# Altium project BEE-1012 PAY-IF V110.PrjPcb (part 3 of 8)
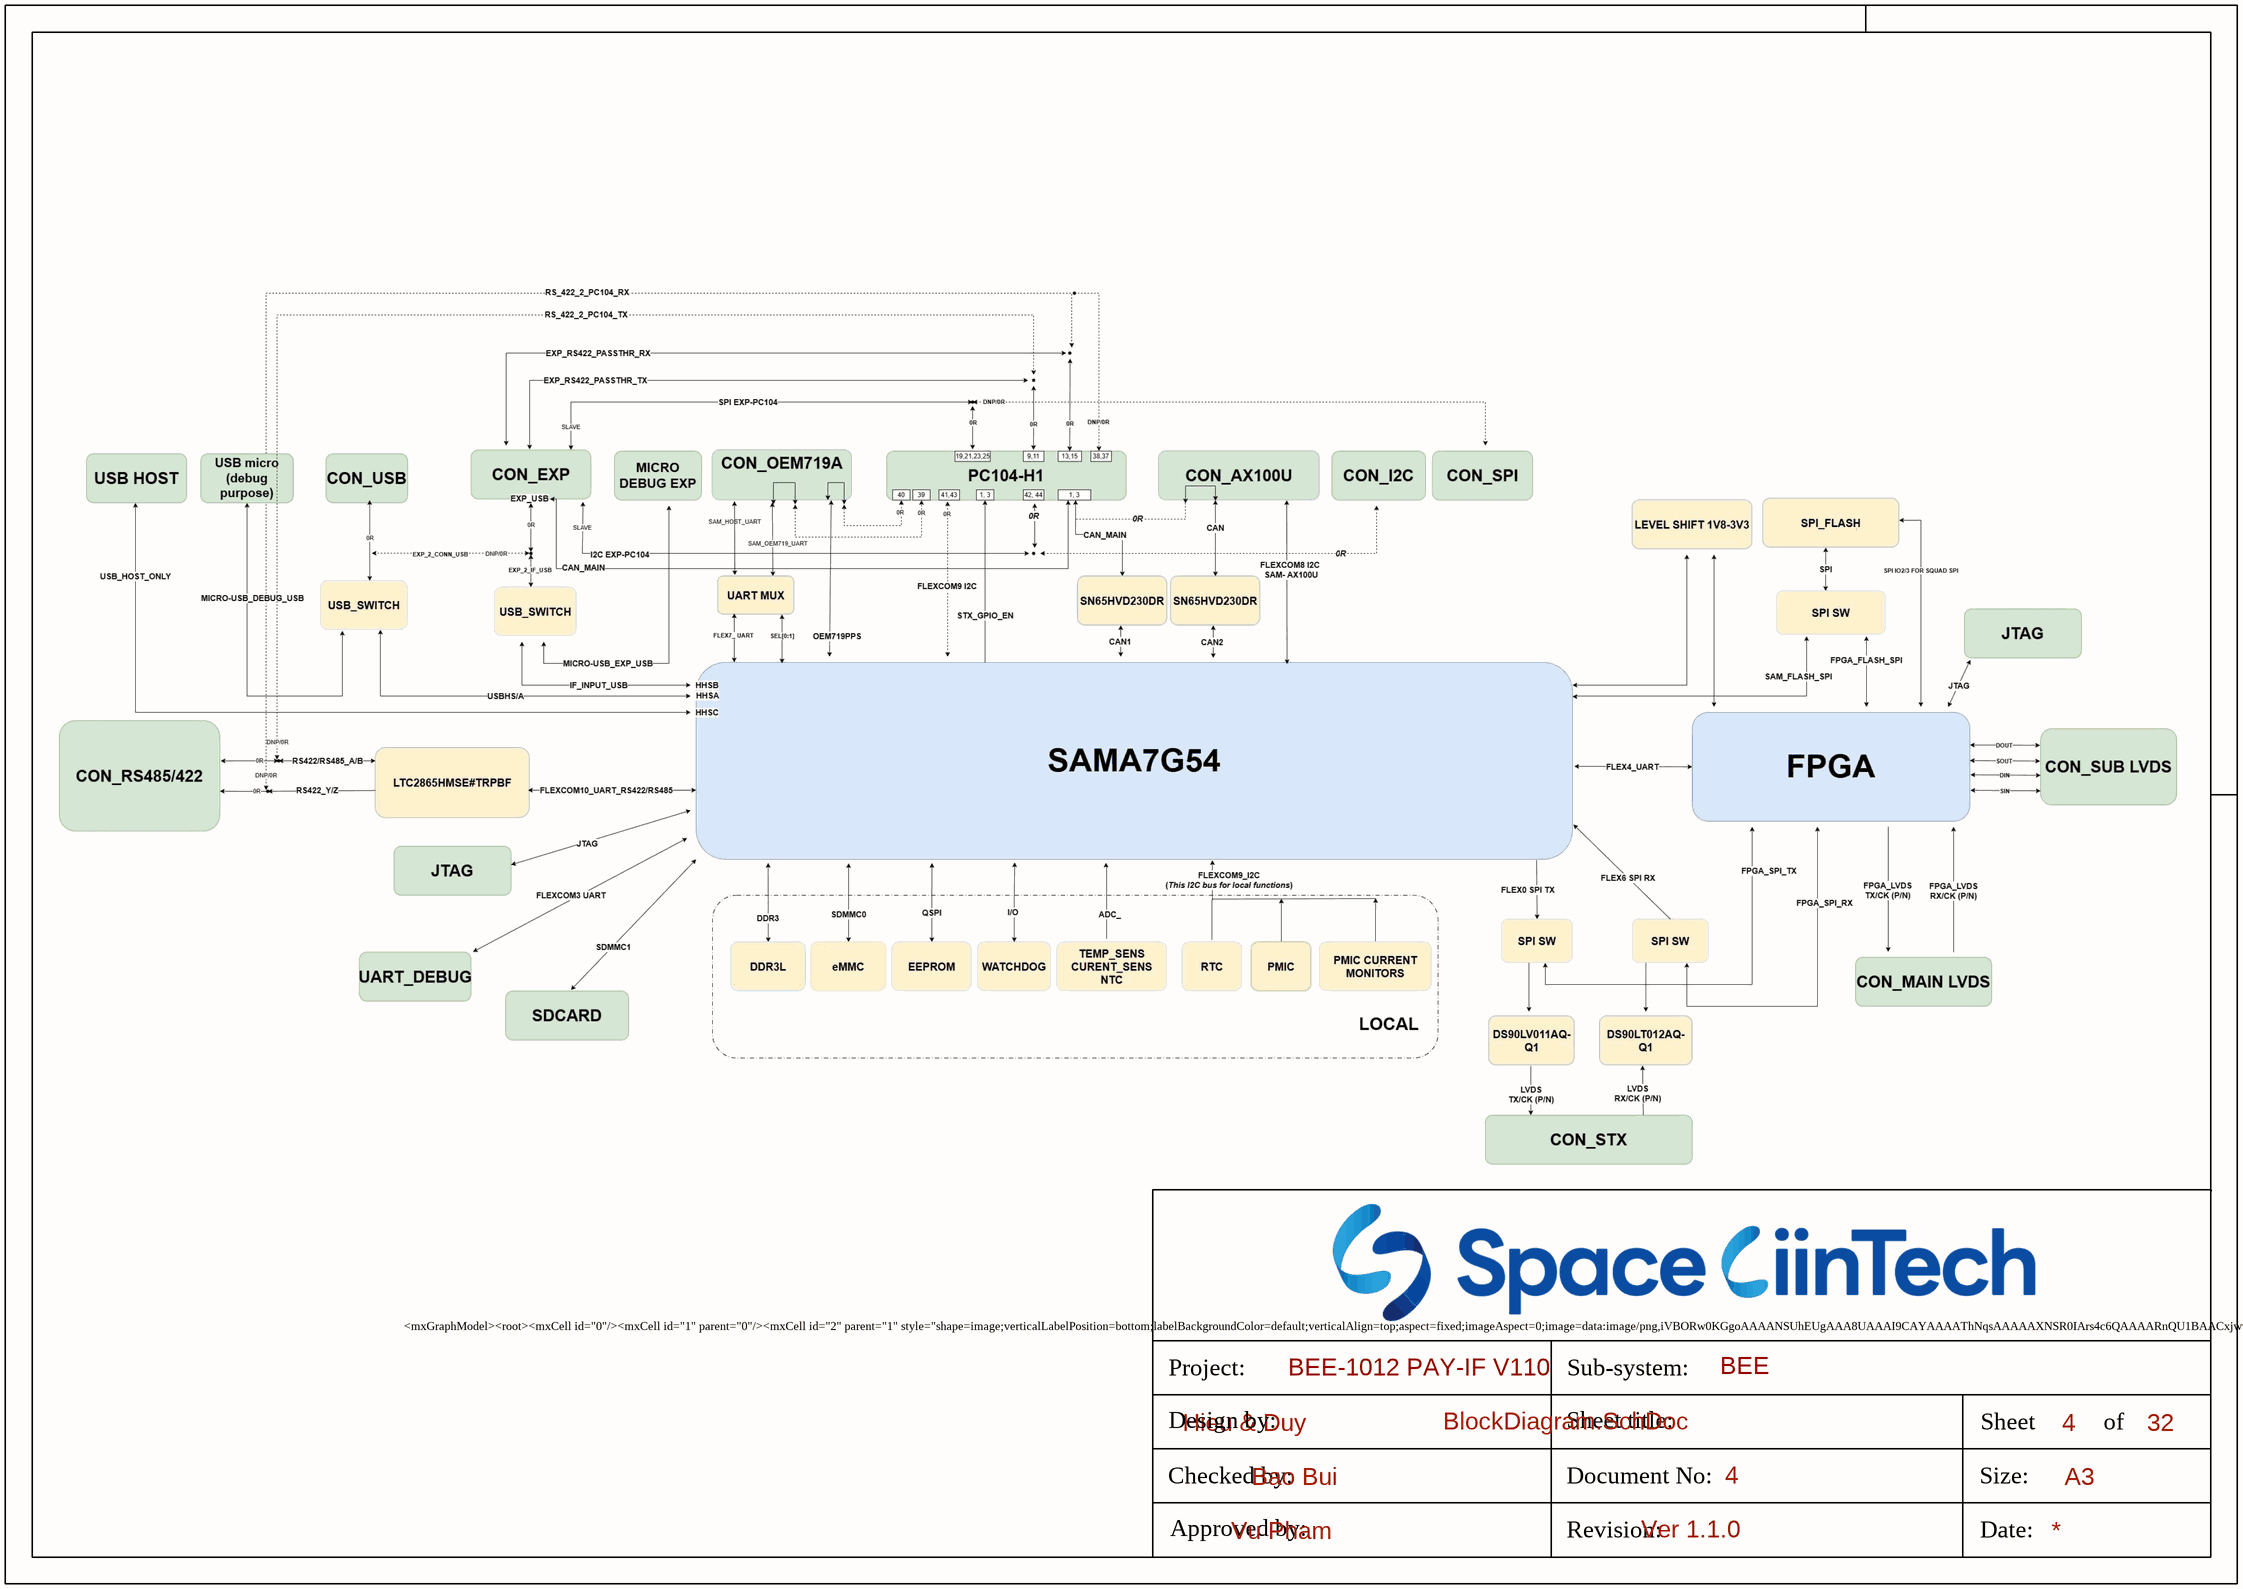
[diagram p40: BlockDiagram.SchDoc]

## Sheet BlockDiagram.SchDoc (continued)

### Notes on the sheet (continued)
JqvcTMV7Viu/XVq8e4P+ysQOpsY+cgftl/CTTGbK1QFBlSKSDqOwohJNKsQKHWWHbZzwsWz9ZQRYEslc7zK4TY5hW1xpJVG/St9bheu8T31fUY6Pg5Rfu2CP3aGnDN+aqy3LYfB0Pe8wbq2GzIe2Ubc1++foxoIiK6HAM1nyaiJixDdA2Yz69L36bTRERE5+Z7VrmQmmIiIiL6HnK8nnhEAiIionNiUExEREThOo9NTEREdNkYFBMREVGwamzirxlSioiIaGgMiomIiChQic+P3T87dWxGRER0udjRFtGJsQzRNWA+JyIiokvme1ZhTTERERERERFdLQbFREREREREdLUYFBMREREREdHVYlBMREREREREV2v0798/99fGO//995/9JyIiIiIiIqJv5d+/f/afAPY+TXR6LEN0DZjPiYiI6JL5nlXYfJqIiIiIiIiuFoNiIiIiIiIiuloMiomIiIiIiOhqMSgmIiIiIiKiq8WgmIiIiIiIiK4Wg2IiIiIiIiK6WgyKiYiIiIiI6GoxKCYiIiIiIqKrxaCYiIiIiIiIrhaDYiIiIiIiIrpaDIqJiIiIiIjoajEoJiIiIiIioqs1UFBcYhGNMBqFTdGitJbPkex/jxawf/Xrtu7RKEHesGx9u1y0bTXSalDmWCQRImsboyhCsshRhqxyr8yxSJJaWqNRhChKtunZyzjVj1mUtO5Jo3wRmdvT+RzaSpT5AklkpxshSjoes++iPLIM5El1DoPyL+rnPwrIxwf1vGNPh7xtL7qTJ/VlOk098ip9tfb8sy3nCRZ52ZiH6gLSNSZXnm9PI/i6fdbyDJT5wnmfOe5YBvoO97YoQdBh1M9X6/WlRL6ob+vX7veR+Q2oH7PWyVV2iIh+ANUiYBalVKYkoBA4ibRoXl6kyv7Vr9u6AaGM1WdS+02qTPvJJZO+/dAUmZLCXrd7ErJlnzuktU0v86fXcMxk2867FKkStbTaj2MjZ3r2JI7b1i+CkDKk73eXMqDlX29+1DmOcfjxdOcd9ySUdGyTXoaOmrocHzobhOTzTvkHuzzUdj1TR6Vbz5pd0hBKZrUEKmcqz0Uma2W5eXKXx8463I8u4t4Wcvz18+W5GIYeb08SW6fc75D9NTiOmXdylR0iou8BnmeVkdrO0Gg0GqFllt1byilWAAABKW/tGQz3T0vEY/0v2vIiRbGewfjZS19WIn2+x409i2GC2Fh5iUU0wXyz+6/MoJax9rumXCCazLGdVSJTSzjnNObbExDyFtsj84GP1cb4XaQF1jPHXucJounKkxbw8bHCxpyh5Tjq50vjXcYtT0aYbg8+hNjstsNzbHys4yZkiuenO0wAAAX+vL5gvjr8irRYw3XILk1QGdL3vct5yBOMtiegOQ9ZykWEySHD7wSv01/ePt/f8bYy86vMFPQiVeYJXt+1GQ70cmHmccP9E5bmBYQuQFA+b8k/+HzH+98PrA7lfKc1f7akW2PfB9CaxufnO97m/rx9cPLybN239oSAvK1KzcfHBzbWzcGfbotvem9rPE97+n41PQNo5wbY5ZGHe9zc7PLt2wr7bNu4zzjDfnvnc/Hn+zpX2SEi+h68zyp2lGwLmKXnW0rVc/k+y+4YNWdNb0ELlWpvdpvfBFtvXYVUaeFMUKkiU6kU2/lcCdo1ekKq5sqJQmX7tPaTK02lrGMmtTfWTfveREtHptrxOaam2Dy+TbUkhV6zf+z5PjOElKEz1SwZx/mocx9S3gqrNjg0P+hlJ3QZuhRB+Two/6htHkqtWjnv/KHp+oSkYeXtpvlOWp7NayUCahKLLD2U9eZ023y3e5vQ1tFyPWmtKQ67P21rgIXn93Psd4f8plTPZYmIvhd4nlUG+qb4mxvP8Cz3/9lg/uj4Jid/rd7KixRPjhfJAJAn2ltqkaJYLzEbN7xVHceYLdcoshTpvZ1gicWj9kZ+l1bzC9ox4uUaRSqqP61eAr6n+oWnw85v8PandYGDcvFyaB2QPt3ZP3djHd/fDW/Zx/ETDru4eUOHzSWYx1k8POHp4XAwO517vzHiZYZDkcIHPodKmq7EGPFsiXWR4nBF28zx2H5BO7Ex4id9m/6iMGc4uTzRa4gF0kJhvYy9NYPjeIblWqHIUjzc+eZs9u3ubbfP2n19hZfWBTzKP3gLuD9hHGO5XjfUEp9pv4mI6CgMineMh/jNHK9GTxI5kkOzKYH0d0PTpHKBl+qpoXk+yzieYWY/N+hBIiSywOZQ49nvKmjEBnNzR9zi+8O+b+avgZ1olPizf0oQDzjyOeug/Pw4/Fs83Hn2dYy7kwRy1yF/r/Lxw90Y47uHwwP+5u1P/WXQ0Sb4peXDv+eOHOhnGM/wWwsKwq9PJzS+0Zr1n/mFj3GPAWTW7ROScTzrNP/BN7236S8wNvPHrw0oz7jfRETUHYPigxjLrKrbWk2rHharGlEA8rnxoSJ/1d4Ce+YLUQUvgEifOnyfO8asej0OrN4DHiJjPB3uuiu8ty9g3ODlc9jN3af4W31AdXvjT80I5BhtdZDjkK32+XN8h+odw5A172PcOD8IJupmPHvWWh0EXp/O5hYtl6tBmfeYzP+d7IC+7b3NbgU2REB5ZOuAs+43ERF1xqBYpzfN3Te3Khd4rHrhQtb4FKIFHABkrclYF3pa2xq9TrSa39CaDD3QXL04mo8bSiwO1QYSvXZ1Z1JVK+IjZIP3Pj5btpUO8vfDy50qf+oPXAM9NAK1PPxr21sa0RH0l3bA6quj4vITh3Yt4teuI8BzMMtU2vQNz+C+973NaAV2bPNjo3XACtMkdKikvfPvNxERdcOg2DDG7LfZ3CrSvgGSmadHZf1BqW+gaKR1TE3EEU1Xu9QYat9XdXvjHaa19ld/QDnyrf01qmoqrPypP3ANVAthtK4YoHk9Xbex3uzgi1+E6bWmQ7SSCdb7vnCk735vM16qNPQZ0sp8MYPVFJNoO/5zkC/ZbyIi6uIEQfFf/Mlz5I1T4E3kKC3rDlm11dzqMCyCp3MtAEDx1xpiYSBH1USYTVfDal7Dawyrh8Ij3ng30GuqW9/mGw8YFET/JlDeWy8yYtxXUXG/5qlliTzRh3wK//6QqNHkV3V9aDXAfQBAUZYo9SlfIIn2Q9AB4ozNlwHrHnPUfeFI3/7eZjXBr/UZEmY8WyOTWi7crDCfTjDqEhzjvPvd3TBlh4joW7K7o7YFzFIfqsE7uYZ+6TMkQId1B6dtp+naZsuQQwUNkJY+bEh9eIim4x0yJE7TsvqQFU3L+pnD+Agl00xlRaGKolBFkaksrYYVqabj1nVOCClDJx3CRakirYb2cI7qoec55wx7dtnwTEK2lxtDSP6jS4WQfN54/WhhDGXjyhtd8mXTesPTaBsC6RTlWS/DzWW0fR8aF20ywP3oYIC0gu9t9o761t06JFOlyKyhwg6TULJpfCXfugMF73fn9NvzTN9tJyK6FPA8q5ygprjNMU2HzqxWE3ktvRy31xjqzWKHbjoYLwujl83VfIrpZILJZILJZIrpfI7VSaosfjqtp/Cm5o8DN6EWaQa1XvbqkIfoUm1WU0xGERJvk5YvULt31Z2ulvHCGcP5HT+81zheYq0KZKm0Wi9ssJpOMIqOaZ5NRERfbfigWKQolIJqnDzf5fbVtu6gIRCssQR3LmIokCO19eas04ewqHe4FRBc9TLGbDeWphR2Y0kBISTSrIBSWscpRzVFuzL6GJu1ptN75guRoDE9hUSaZciyDFmWQmpNCzfzKaKQNIi6aivzQ9wHGtIoikJrQrvBaj45Wz43vqtuMp7h96FMVlOqN/v9Qbrc2+xenPvd03fjaKv9/Ur7aTPH5MSBcbf97qAh33cqO0RE39TwQfE3Vy4eq7EEZYZMG6pomnhuofo3b307f+qdVglt2N9ufB1uacMwnaKDrb1xPMNyvbZuyGus10vM4rFZG3J7w5t0i/LPW9Ux0P3E/E5SmyZVVBw4ZvEv3MUx4jhGHM+wXK6hCr2jugl8RYYomP5d6xeW+fF4jHi5htKG7+sXXB3J05pjfCiT1XT3y56rg973I03vtHrc2wAgXqI6dYEv/1ps71eF9qywDYyN75a/er+JiKgVg2JDjldr+KVY76BjNW1+yDeGbOg5ZELvtApUw/52rdEd466Kio0Ot6rei4frYOso2gOy+Clj/RjnfEh6ngZW031zdMe070EIjhciocYzrPXxvmutDYi6M8Z4vYQybw3fV/vU5BTl+auG5el9P9L0TqvPvW1Lbw21mT/6O3UMNkY8W2sBtzV02AXsNxER+TEo1uTJ9PC9bFUTao2R2fiQbw6Z0O8b5J5paePRtjY1dDB66tzXSBi9Fz9/6bei+gPyyZqRfaUONQllW/WBnhc6OSLf7Vnf7h3T0ytRxRwn9zLKfIfegAcrz/onDv4RAobV835k6JlWz3sbsH1xp48wMeRxjLXWNubQYRew30RE5MWgeC9PDkNtABLPWtQ3nv0O6KBDr2Ht26TOSiuoKeteicUhegXEw90RTQ3r35eaTXC/8DW1Hpz/qDfm+kOTo+bJSf/G2117r79AkJnjGzF70ps/d8p3OjP/GjUmRB2ZY163DI13MU5Tno2gy9dyaVA/6d62FS+1filWL1iEvrU42mXsNxERNWNQDNRuOjKzOwML66DDqGHFCtPQzjbKvDbOoT2uojsQr8uTSfVNtBXcd2E0MXt7xGP1MfGXPpRWYySf9rvm87MCyWnizGMG7RtviAfUn6H1GrbAFwjGN+XH1/KarQ1axp0malDmiTbm9fA93h/P/MazXnt9ivJsN9sGVtPoLGXrJ93btvQWYBvMX96s349jNPO3gtfL2G8iImrCoBhW51pNQZ/VQYe7060YS/2jos0ckyhpHvC+zLFIIowmU8zf7VfVZrPtzXyCKFn404pGWm23K7jvwAiONlUg+mVvqUtz/0SK3z/s4aD+4Nmcd8pFhJF2sp3BgtbkLvwFwlC1vGZTz87NBenKlciTyPzOXWZYhmXiEyuRJ9o9o+GF0+DlGdi+oF1rtZzYYD6JkCxyT5Baovhr/62rH3Rv2zFbgFX3OJc8GWEUJcjLpo3cnsNqG101/Zex30RE5DZSSin7j7rRaISWWQDkSEa773FFiqJzt/3a8hCQ0t9Fyf3TEvFhBfq6JdLne9wYc9dN4ljbPnPdabFu/l62XCCa7Gsqm+ctF5FRu7ElIOTtrrOND3ysrJuwzKAcT3x5EmFqD84rBOSt1m3Hxwobe5a0wNq1cUDw+arvh0TWOKRWiUW0f6Ptm69JtU1CSjz8usfNDQB84v39DSvjGDQf+0sUVoZ28sR4OAas8/3xgZV1soXMsK7lHf18dDxeRj63z2VY3gHa0nHRy2LI/HRJwvJ527XecW3E9vpYLPXrtq3vfQBBaXx+vuNtvjK2T2aqOVgfrDxbjLKlMe4NH/j42HS8N/jV7wnAxd7bGtZrcJ2f2nL6tXRLCIFb7Tib9yf/Np58v53lyjTsMxQR0ffhfVZRLQJmUUplSgIKgIJIVWH/3EpbPmCS2fHLAkKl2gZmUvvNTNjJmN+zr0Umlait2z0J2ZyOUkoVaXhaEFKlmS811eF8WcfWe3wKlYr9vFL55nQLPI9CqtbduzAIKkOaIlXycCx9k1BSz8y6Iq3yjPccu+jn0lPeWtP1peOi54Fj8hB9pbB8HljOD5NQMqjAd0+3XnS6pxG0bUOUZ6dCZVI40mme2u41Ib7Nva39glO7RjUtl6WhxznsHJ50vwOmxmt60OQqO0RE3wM8zyrNv+z4Fq50eVB2cdyYPJN5Qe+2rHFBNwKH0IfwTHvAabs5FKrIUiWFqN0AhZBKppkqvMvrmtOCEErINODGuWc+OPiWqh662vf1cB5EGngsLUWmUimVsM/nbv+y8IN1URBUhmzN51sIsc079iK6TFbz+0+cU6E/BBoFrmNZ17bD9bBpynq+WKGvFJbP26/XovP1TAWla06u61lIGkKJXZBSW9yrZ3n2KlSWutPeXjuP2d42vv25nHtbGP2e7rleFoXKUunczuPO4ZD7HZJ3q2mwZygiom8GnmeVgZpPE1ETliG6BsznREREdMl8zyrsaIuIiIiIiIiuFoNiIiIiIiIiuloMiomIiIiIiOhqMSgmIiIiIiKiq8WgmIiIiIiIiK4Wg2IiIiIiIiK6WgyKiYiIiIiI6GoxKCYiIiIiIqKrxaCYiIiIiIiIrtbo379/yv6j7r///rP/RERERERERPSt/Pv3z/4TAGCklPIGxaPRCC2zEJEHyxBdA+ZzIiIiumS+ZxU2nyYiIiIiIqKrxaCYiIiIiIiIrhaDYiIiIiIiIrpaDIqJiIiIiIjoajEoJiIiIiIioqvFoJiIiIiIiIiuFoNiIiIiIiIiuloMiomIiIiIiOhqMSgmIiIiIiKiq8WgmIiI6MTKRYTRaITRKMKitH+lofA4ExHRMRgUExERnVSJP2+b3b9vcTO2fqaB8DgTEdFxGBQTERGdUvkHh1hN3iO2fqaB8DgTEf3/9u5fyU2dDQP448v4Tu3dIpMrkK/AmyZV2u2gtJt0KdOlwaXdpd1qmwNXYF/BToqFOucy9BX+gwSSECAwXj+/GWaStZHFiyRLWAjqKNCguMBmMTtNWWreFrU5TRni8+uLDaqvurX77NksRmbZt54vEyWvWloWRYZNvMCiksfFYoF4k6Hw+cizIsMmjmtpzWYLLBbxMb3qPkb1mC3ixiOxyi7T1U5b63PoUmAT95gOd46/IV6brG1iQ2pRByzlYLFYIM4K9742IcspkVW97alulzJX3fUki+v7tNqa2roB6kLx7wvKsVp1qNYUk7K9cn90PZ1x2vUWbZeKcQZuNM69dM1P0fH4s7j8DGMHon4+q1tTmxRWPT/jlC8DS1+jd59zEfv15dRzbo2BvVwM+l0xVGwMW/vyVyDb1PPWWMcIkA083iKlTGUESHhuIsnt+4tEVl91a/fZgJDax6eR8lokU+UlkzRyHYciT2Ukqp9t3kTUcMwt0jqml7rTs8Qsajp4kzyRopZWcxx95GlUSbty7pxymUaidoy1rXV5aw9t65AtT77lQEQyNSZg4JumTzmlu4a25bxxEzIyVHi1De609a1fretCU91uFxNDSE7M6QzfrjcdXwXjXLrJOHfUNz9qrHyO/0zp45n7bObzad7MbVJY5vwMX74ULc4VuvY5fc6hmn9rAOz1YpDvijFiY92ay1+932zerOG8A3D0VWby+Aar2WyGhrecrtQ8YQcAEIiiz9U3aL5+32Kp3euj7C8S5PsV/G8FUveNkPz4isfqWzQPWGofXmCzeMD6cnk5hdxWrzCfFBssHtanK9ERUrk1T8/S3ncmIKLPOEbmDW+7g/a6SHLsV4ajzmIsnnaOtIC3tx0O+hsa4qieL4VzH7MsnuHpGHwIcTjlwxEbLwWy+BlPu9pBIcn3MIWpqswXTvH6hh9fHwG84/31BWs1bdc5D6B1HbKcB/2YACEifP4MY3mypaEJWU7p7rUv5/X2+v31FS87vb2LUgm1ehZZjF+vyhsu1PKqt5Gar9+x1b+Ahq0LWYzZqeKa93HF5NhevWifbWsHr9WuN7ddF4yz5ibj3EWI/KhpNB2/qle58GuTwrpW+ToZsc/ZGEf1nFv7afZ6Efy7YujY9C1/SlkHTul9+4rHRwDvr3h92eHc9TXXhfvg7KtUR8lVHm9xXqnx02f/PvueaFfTbFeIc5koV4fsV1kqV31EJJPcmKCUeSqT86+ZpgSrV/mcvwAafhk1pSllJWaRctXLduw2SjpRosTH40qkTZ7oV+FEIpPL1T7P/FV//TftU4mtNVQBIFAdSiNxKgOmV+vn331MAcspUcByfizLStn0bk/UMu27jxy8LpTHYmu//GKifv+Y33etdt0n/5JxrrnNOLcXKD9j/FJsTbdrm9TFtcpXvV80TJ9TKJ/hyIus5Mcrbdv5q1LLZEMezkaJjS3/PuVPb7vMZf1YxyIh7K/fATj6KvZXTlw7l3xOqkuf/fvsW9IKnCkddaBlev2kMR2DPE1kUivhPl/OdXmiVkRbI1qJWeOXhln5WUImuZpfU4X1oTZU5TSR5s6OyvfiRSVWrjf2hFHqkKwdu+uYwpVToqOw5VxvC5rrvezW0Rm8Lvgcr897pEdMrtWu++WfcdbdZpzbC5afqw6KpUe5COVa5WukPmeUtrgNUTnn1v6M7/lTtf2uGCk2znQbyl/X+nGH4OirBFpo6/Yttymi838Oa/zS7q/PEF+mJAgkvy3TIIoNfl5mLjjeVzFfrrCqToXIfpVTuhEhtU690M1Xv5GI8/8OWOsHYrb8ejn2w/pX8+JhAKA++kJ8wxefzPkSEdJ8j22XqR3q6qMiwfdqXBXzL99wCdXu1fO4p2yOL98uRwS8vZsXZghZTokG8YBPSjv2J9dfDWboupC9XqYMim9fvNK2W+Jr+SWFl3+Ntbs0pXadca640Ti3NbX89DJSm1Q1Vvkasc+5/J5c+l6H9bPfolvXNGJs7K5U/u4MB8UXS2zTyzchdk/lytLF5md5L0T0w3CP0VH2S7lnxvE+H9lreV+ASL7b7/+omWP1ozwOv8HeEt8vNXeH1+YdtEYi+uHXQDRb4nuaI99X7zlvIf9TnoPPj+58zb+gHEO+4X3qDXNbluMPWU6JhjHHo/Emr7CGrgtlOx7hR4DEH8pekYeptOuMc82NxrmtqeWnn3HapLpxyteofc75CuUufQeLwxs1NlYtyt/hDzhm7oaDYtXyu3JVZ4efmwIoNnguV+FCary7HQAyKPXG8DiINtS0BL55XeZTKFcWfQd76q+mu59NS/YX2Fwu/0bodagV8+XcqwG3Kd7fLv8Wnx601+rURuZjXHnL/1y6IBYhyynRUPQ2sLEqdzJwXVB/JYvCPDO3uX7rptGuM866G41za1PLT19jtElmw5ev8fuc2uzM3c8J/1o8fmzMGsrf/FFZLGyHp7jNI5zojINizRyr3/q0jsVzeaUzSh0r9hXvKIdjvg2RhZbWZzy2rIOdplmov5oeXuCcMaZMUW531Wx4amfmc8vAvXVvrSbCoxMSspwSDUSbneM7/a+tgeuC+5m5XRRQrvn5tW9TaNcZZ92Nxrm1qeWnp1HaJJuhy9c1+pzaL+AHrJ+bBvtXcpXY1DWXPzWeAHZPeDg9d538DTAo/oN/swyZdRvyBDV8ts9HV6Z1XJZWb7g/VZu2G5L4hOoFoWb6NAu/wZ46zcM9naWcEtXhqtnEtJsmN3HKfXXWTshQ5ZQohKJAFi/wcJmd438fYmuD1gXlnj5bXWxLXS/BO80JtOuMs+Y249zB1PLT1ZhtktWI5Wu0PicwX/1wrOUzQSPG5qJF+Zuv9kgjpU972GH99IAZB8fewg+KDzusn57wZN0GvKm+6bM9r0Rp0zoAZyE06lRxFNf6MlGneVjvfVB+jTRerbom9Qq/YXrJh6YuBud5hbhvOSXq47DGw2yGmbo9PJTPJxeR5TmxAwhdF9SBVYgpvUWGWH3Oa5s0p9SuM863Gee+ppYfmym1SVVDlq9r9Tmra/k0Tg2/gjFjE6D8Lbd75GlULiILZXA8WyDm4Ngp/KC4UZfpByPTpksAXitQfgjqqpvmBR3UKRy+CzjQ8LL49PB3ABAJfrtaTaKJE0kKud86v/ynrPuU3upspw3ieIHZg16/c+vaFiYft11nnGks12+TPmj5UtfyOazxPNivZretTfmbL7fYyxxpUhkc44Dd0wNmiwlefJiI8INikSA/Pv/Ysjnuy+2r6bO9llEvsFHuIz7zXwp/erzuiTpRl8qvX7UbYKpaUB9v4SwfxWaB8kdi/8cFEF2ViJCkKdI0RZomiJRpX4f1ExY32znK8Os81a3ptpuq2mynNXbnXwkAiChB3qF+33a7bsM4U2ATb5NupXy16XNWV2i+5b62D2dsgpa/OZarLfZSIk8TqLOqcVjjgQNjo/CD4htXbJ7L55FFKVJlKfyn2FFVHz6VV2T6LofeOy19oZBWXAs6KMv8e03PvTHOxmqqsli/1yRvuOjUu2wRhfIJX5ZLLJdLLJcrbLd7yFxd6PABria3t6HqQtBn5gIQAiJKkOYS+237gRpw5XadcT661Th3NbX8eLlym9RkqPLV+1z16HMCwHKLchb16ckvUzFqbIYpf/PlCtt9roxncBv3cF8BB8Ua5crz6fFLS3UhgN2TvUBqy6H3WXY9RFo5ykWY214xnONL2epqCzqUz2rruIDDCNSFs3wWNGj76I1JyWLMLj8Ri8Z7TYAQZYtoQPMV9mPdYzZQXejVTppmO+332G9X3Z/dDly3XWecgb759TFQnDsLnR8tvRGN2SY1Gqh89T5XffqcR+qv4If1gGsPtXXt2AQrf3MsV3vl4gOwM83Bv3McFCvU+zLLK236Muf2Aqkvu97vHuSeaamrEHdY4EJbEfC8oIP2LMgfzYOvCTg0zp++4YW5shgLZUAcpR4DYqB/2SIaWuUes+GuZg9RFzoudDOC67XrjPPtxrmPAfPT4he7wv9nOrvR2qRmw5SvnueqZ58TOA7+1Ce/uFbYHtcEYhOw/C3LG9OBt3fLeOZ+cVB8lsXafZk/lFZlvvrtsRCAegWv730RlbRe/m1RcNUHt3edVqYv6PBzU/RY0GRc6kPuGyu8unLpxDpWTsUGi6fd5bELUbqH/3owIcsp0RD0Mjrc1ewB6kLoKb1BXatdZ5xvNs69hM6POjgxLzRVp95n2+EX1Iux2iQfQ5Sva/c5j7Qnv+x+YuN75WNQU4jNlMrfx8ZBMVAruFFavS/TbyEA7QoednjyvZG9yGrPEKs+v808EK/L4ofynujK4L4NbSrLyzOeuy5oMjZ1qkvDFTX1i6R7YzWyYoOF8siQdgPio5DllGgI+q8hPwebShe6LpRTGLu3vUO6VrvOON9mnPsKm5/KwOApNvbDNMp9tn0vfI/VJvkYonxdu895pM7MPGD986Xy+nVMITahyl/Zdt5Qv3dEHBSjsriWrVGpLARgXnRLf+bacYW3GLW2/azIsDk9BmL9Wr0kpk/bPqwfsIg37rQWM+XXbtPgvgVtQYfDDQ0eK9PdLV+chbZAVb/GajS1AXHeekB8FLKcEg1B/TWkw5Q1bwHrgjaFscXzbcd0tXadccatxTmIsPmpD7LtaRWbhbLmRohHFI3VJnkYpHxduc95os/MLI/tuqYQG3f5y+IZZosYWWHLVPVJJX1mTnxgsoHHW6SUqYwACUBCJDKvvtxI2R9CRlHk3FLtA9TPjmSSpjJt2PT86Z+duDKfJ1J4vDdPxOk96iakuByDUNI5bVFaTUZKKWUaGdISeoyEqH4WpLBlTkrv81U/jkiacymllLlMLvlwvc8tN5yvMl0ho6TyujHz6jk97iei5LRPIiOhH5cl9MEgSB1S41svA7YtMQdISuP5PceqfTklClPOFVp769OmqPXe5/2lEHVBTaNdNWkREye/dOrH6oqVT7vu97nS+NmM89H04hxS0PykUT0t9fuw8v0OQApbWlK2imv7NqkLv/zUY+rKj0/5Ohq8z+k8Fyemc2zdzy9eum7fFYPHpin/1vJX6R8CUmj5qufbnaePDY6+iv2VE9fOpRYn1UgtoM2bXjfa7VsdzKaR8pq10pW09zuONU+jeiNv2URkT0dKKfPEP63jhQFXarLF+arE1hkf/0bXru25dOQ/T2VkaJz0TcioMVb9IUgd6hAba1qlkOWU7huClHOV/kXvbH6k7NzROetXF/q0f21i4uKbTuh23fdzjxhnE5/j8v3co35xDi9ofvLE4/sdpwvpzpRaxrVtm9SFb35Cl6/SoH1OZz7P6oM8+36+8VJ1/64YNDaN+beXv7R2kcS2+dSJjw2OvspEpk+rCyi01WNfdRqWOD6Cqclym5YPwa4+J04xX26xl/npodmiXPzpRIgIUZIi93gm4nzlTuv8fMUkzSH3W6zaPFPi82P1L4olvl4OViAxzis3EJ+qf/HU41xWzZfY7nPkaQQhKokKcYr9Hts2sbqyTrH5/OguWwHLKVFY+loOPouLdKojJ73qgrpo3xSm9E6qXdcxzg2mEOcBBM3P/PjcVXtap+94ucc26K1R7dukXq5Uvgbtc3qZY7VX+toARODHg3T9rrhubOzlb7naQ+Y50iQy5mu4OvGxzORx1Gw1m83Q8BYicmAdontwz+W82CwuaxREqex4rz81YZyJiKgPV19lIr8UExER3aIMvwKs/kpNGGciIhoOB8VERERdTfqZuR8I40xERAPioJiIiKij8rmPfMTFkBhnIiIaEgfFREREnRR4fzv9U3wDx2pDYZzHkSGezTDruS02lhVIPyTGjOij4KCYiIiokzlWewkpJeS+YcVc6oFxJiKiYXH1aaKBsQ7RPWA5JyIioilz9VX4SzERERERERHdLQ6KiYiIiIiI6G5xUExERERERER3a/b371/zxOqTf/75p/onIiIiIiIiopvy9+/f6p8An4W2/vvvP/zvf/+r/pmIPLEO0T1gOSciIqIpc/VVOH2aiIiIiIiI7hYHxURERERERHS3OCgmIiIiIiKiu8VBMREREREREd0tDoqJiIiIiIjobnFQTERERERERHeLg2IiIiIiIiK6WxwUExERERER0d3ioJiIiIiIiIju1v8BdRxHBGg25tMAAAAASUVORK5CYII=;" value="" vertex="1"><mxGeometry height="614" width="1034.06" x="738" y="1685" as="geometry"/></mxCell></root></mxGraphModel>

## Sheet Power.SchDoc
size 420 x 297 mm; SheetNumber: 5; SheetTotal: 32
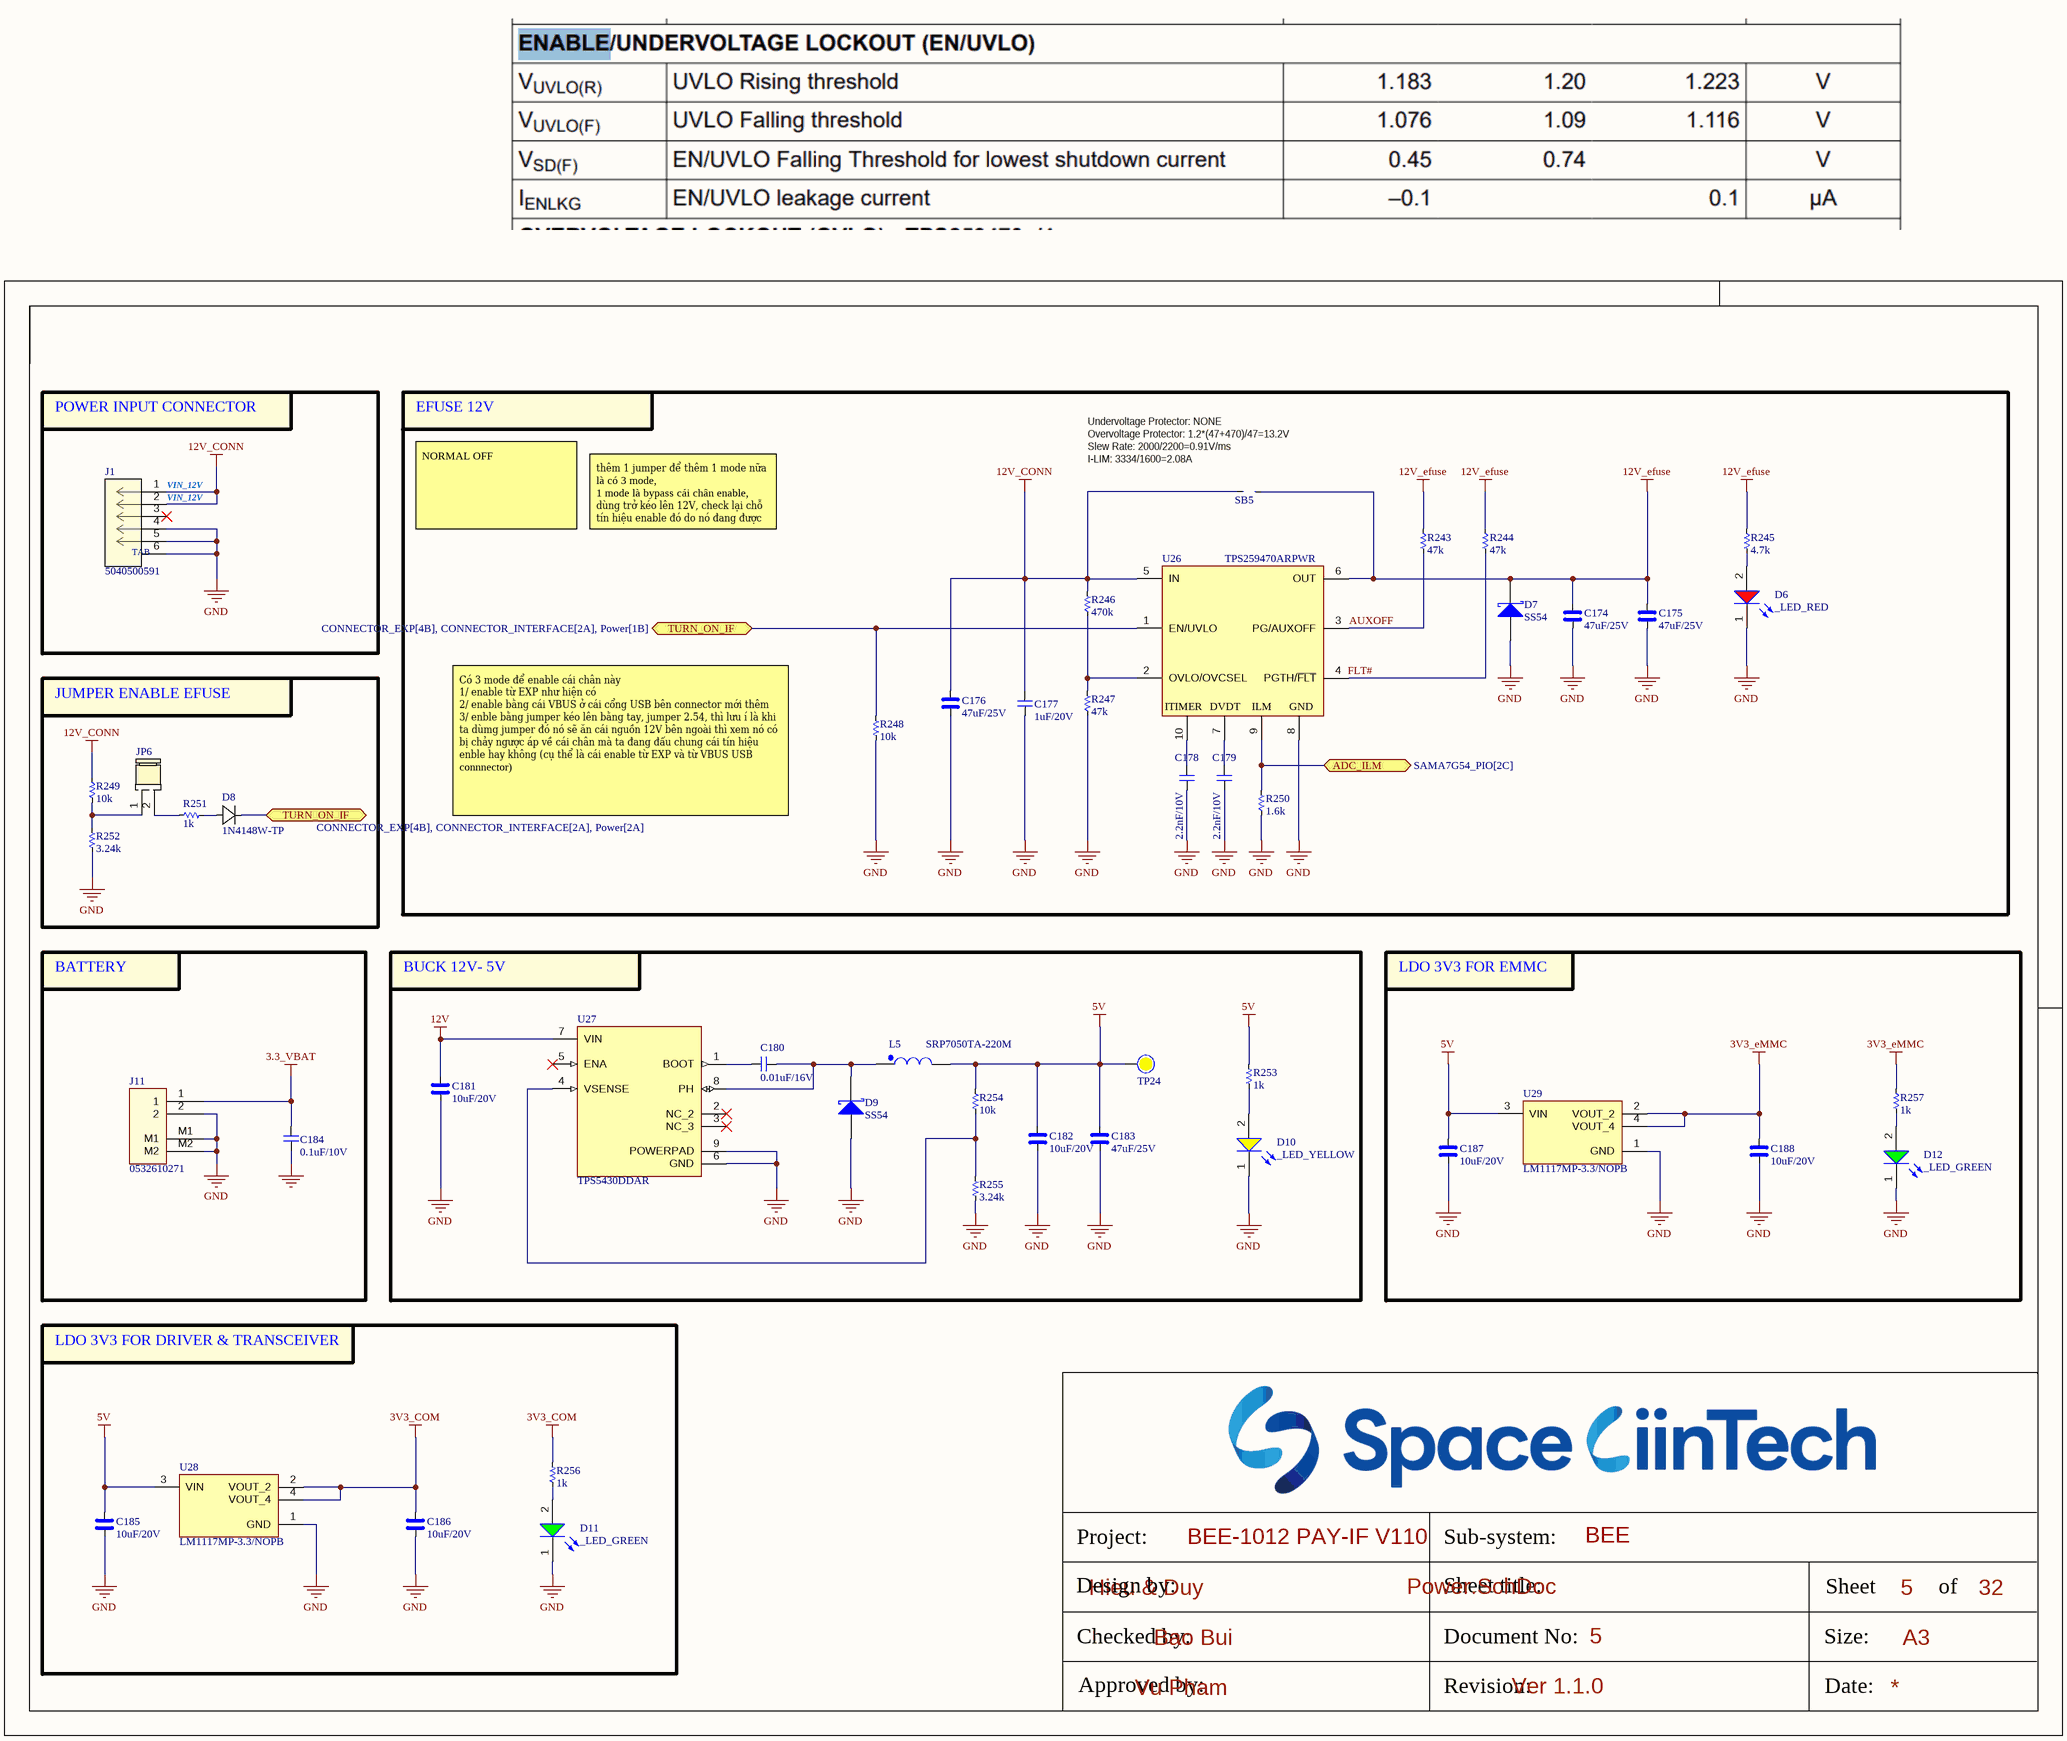
[diagram p4: Power.SchDoc]

### Parts
(Parts that share a designator on the sheet are numbered #1, #2 ... from top to bottom, then left to right.)
C174  47uF/25V  [CAP_C_3225X80]
C175  47uF/25V  [CAP_C_3225X80]
C176  47uF/25V  [CAP_C_3225X80]
C177  1uF/20V  [CAP_C_1005X50_L]
C178  2.2nF/10V  [CAP_C_1005X50_L]
C179  2.2nF/10V  [CAP_C_1005X50_L]
C180#1  0.01uF/16V  [CAP_C_1608X80_L]
C181  10uF/20V  [CAP_C_2012X110]
C182  10uF/20V  [CAP_C_2012X110]
C183  47uF/25V  [CAP_C_3225X80]
C184  0.1uF/10V  [CAP_C_1005X50_L]
C185  10uF/20V  [CAP_C_2012X110]
C186  10uF/20V  [CAP_C_2012X110]
C187  10uF/20V  [CAP_C_2012X110]
C188  10uF/20V  [CAP_C_2012X110]
D6  _LED_RED  [LED_0603]
D7  SS54  [DO-214AC_SMA]
D8  1N4148W-TP  [SOD123_MCC]
D9  SS54  [DO-214AC_SMA]
D10  _LED_YELLOW  [LED_0603]
D11  _LED_GREEN  [LED_0603]
D12  _LED_GREEN  [LED_0603]
J1  5040500591  [5040500591]
J11  0532610271  [MOLEX_0532610271]
JP6  JUMPER_254P_NOPLACE  [JUMPER_254P_2X1_ANGLE]  (value not drawn)
L5  SRP7050TA-220M  [SRP7050TA-220M]
R243  47k  [RES_C_1005x30_L]
R244  47k  [RES_C_1005x30_L]
R245  4.7k  [RES_C_1005x30_L]
R246  470k  [RES_C_1005x30_L]
R247  47k  [RES_C_1005x30_L]
R248  10k  [RES_C_1005x30_L]
R249  10k  [RES_C_1005x30_L]
R250  1.6k  [RES_C_1005x30_L]
R251  1k  [RES_C_1005x30_L]
R252  3.24k  [RES_C_1005x30_L]
R253  1k  [RES_C_1005x30_L]
R254  10k  [RES_C_1005x30_L]
R255  3.24k  [RES_C_1005x30_L]
R256  1k  [RES_C_1005x30_L]
R257  1k  [RES_C_1005x30_L]
SB5  JUMPER  [JUMPER_1608]  (value not drawn)
TP24  (no value)  [Testpoint_80_pin0]  (no BOM)
U26  TPS259470ARPWR  [VQFN-HR-10]
U27  TPS5430DDAR  [CONV_TPS5430DDAR]
U28  LM1117MP-3.3/NOPB  [VREG_LM1117MP-3.3/NOPB]
U29  LM1117MP-3.3/NOPB  [VREG_LM1117MP-3.3/NOPB]

### Blocks framed on the sheet
POWER INPUT CONNECTOR: J1
EFUSE 12V: C174-C179 D6 D7 R243-R248 R250 SB5 U26
JUMPER ENABLE EFUSE: D8 JP6 R249 R251 R252
BATTERY: C184 J11
BUCK 12V- 5V: C180#1 C181-C183 D9 D10 L5 R253-R255 TP24 U27
LDO 3V3 FOR EMMC: C187 C188 D12 R257 U29
LDO 3V3 FOR DRIVER & TRANSCEIVER: C185 C186 D11 R256 U28

### Ports
ADC_ILM (bidir, see SAMA7G54_PIO[2C]), TURN_ON_IF (bidir, see CONNECTOR_EXP[4B], CONNECTOR_INTERFACE[2A], Power[1B]), TURN_ON_IF (bidir, see CONNECTOR_EXP[4B], CONNECTOR_INTERFACE[2A], Power[2A])

### Nets
3.3_VBAT: C184.1 J11.1
3V3_COM: C186.2 R256.2 U28.2(VOUT_2) U28.4(VOUT_4)
3V3_eMMC: C188.2 R257.2 U29.2(VOUT_2) U29.4(VOUT_4)
5V: C182.2 C183.2 C185.2 C187.2 L5.2 R253.2 R254.1 TP24.0 U28.3(VIN) U29.3(VIN)
12V: C181.2 U27.7(VIN)
12V_CONN: C176.2 C177.2 J1.1 J1.2 R246.1 R249.2 SB5.1 U26.5(IN)
12V_efuse: C174.2 C175.2 D7.1(K) R243.2 R244.2 R245.2 SB5.2 U26.6(OUT)
GND: C174.1 C175.1 C176.1 C177.1 C178.1 C179.1 C181.1 C182.1 C183.1 C184.2 C185.1 C186.1 C187.1 C188.1 D6.1(K) D7.2(A) D9.2(A) D10.1(K) D11.1(K) D12.1(K) J1.4 J1.5 J1.6 J11.2 J11.M1 J11.M2 R247.2 R248.2 R250.2 R252.2 R255.2 U26.8(GND) U27.6(GND) U27.9(POWERPAD) U28.1(GND) U29.1(GND)
AUXOFF: R243.1 U26.3(PG/AUXOFF)
FLT#: R244.1 U26.4(PGTH/~{FLT})
NetC178_2: C178.2 U26.10(ITIMER)
NetC179_2: C179.2 U26.7(DVDT)
NetC180#1_1: C180#1.1 D9.1(K) L5.1 U27.8(PH)
NetC180#1_2: C180#1.2 U27.1(BOOT)
NetD6_2: D6.2(A) R245.1
NetD8_1: D8.1 R248.1 U26.1(EN/UVLO) ; port TURN_ON_IF
NetD8_2: D8.2 R251.2
NetD10_2: D10.2(A) R253.1
NetD11_2: D11.2(A) R256.1
NetD12_2: D12.2(A) R257.1
NetJP6_1: JP6.1 R249.1 R252.1
NetJP6_2: JP6.2 R251.1
NetR136_1: R250.1 U26.9(ILM) ; port ADC_ILM
NetR246_2: R246.2 R247.1 U26.2(OVLO/OVCSEL)
NetR254_2: R254.2 R255.1 U27.4(VSENSE)

Not connected (* = marked no-connect by the designer): J1 3*; U27 2(NC_2)* 3(NC_3)* 5(ENA)*

### Notes on the sheet
- Undervoltage Protector: NONE
- Overvoltage Protector: 1.2*(47+470)/47=13.2V
- (near SB5) Slew Rate: 2000/2200=0.91V/ms
- (near J1) VIN_12V
- (near SB5) I-LIM: 3334/1600=2.08A
- NORMAL OFF
- thêm 1 jumper để thêm 1 mode nữa là có 3 mode,
  1 mode là bypass cái chân enable, dùng trở kéo lên 12V, check lại chỗ tín hiệu enable đó do nó đang được enable bởi EXP và cái VBUS bên connector
- Có 3 mode để enable cái chân này
  1/ enable từ EXP như hiện có
  2/ enable bằng cái VBUS ở cái cổng USB bên connector mới thêm
  3/ enble bằng jumper kéo lên bằng tay, jumper 2.54, thì lưu í là khi ta dùmg jumper đó nó sẽ ăn cái nguồn 12V bên ngoài thì xem nó có bị chảy ngược áp về cái chân mà ta đang đấu chung cái tín hiệu enble hay không (cụ thể là cái enable từ EXP và từ VBUS USB connnector)
- Project:
- Sub-system:
- Design by:
- Sheet title:
- Sheet
- A3
- of
- Checked by:
- Approved by:
- Revision:
- Document No:
- Size:
- Date:
- (in symbol 5040500591) TAB

### Library data of the parts
C174-C176 C181-C183 C185-C188 = _CAP_C_High_2: CAP CHIP High Value
C177-C179 C180#1 = _CAP_C_2: CAP CHIP
C184 = _CAP_C_2: CAP
D6 = LED_RED: LED RED CLEAR 0603 SMD
D7 D9 = SS54: DIODE SCHOTTKY 40V 5A SMA; MPN: SS34; Solder: SMT; Value: SS34; MFR: *
D8 = 1N4148W-TP: Description; Manufacturer_Name: MCC; Copyright: Copyright (C) 2026 Ultra Librarian. All rights reserved.; Manufacturer_Part_Number: 1N4148W-TP
D10 = LED_YELLOW: LED YELLOW CLEAR 603 SMD
D11 D12 = LED_GREEN: LED GREEN CLEAR 0603 SMD
J1 = 5040500591: 1.50mm Pitch, Pico-Lock PCB Header, Single Row, Right-Angle, Surface Mount, Gold (Au) Plating, Positive Lock, 5 Circuits, Tape and Reel; Manufacturer_Name: Molex Connector Corporation; Copyright: Copyright (C) 2025 Ultra Librarian. All rights reserved.; Manufacturer_Part_Number: 5040500591; RefDes: RefDes; Type: Type
J11 = Header 2x1_2M
L5 = _IND: FIXED IND 22UH 2.5A 170 MOHM SMD
R243-R257 = _RES_B_2: RES
TP24 = Test Point: Solder: NF
U27 = TPS5430DDAR: 5.5V to 36V Input, 3A, 500kHz Step-Down Converter; MF: Texas Instruments; Package: HSOIC-8 Texas Instruments; Check_prices: https://www.snapeda.com/parts/TPS5430DDAR/Texas+Instruments/view-part/?ref=eda; Value: *; Purchase-URL: https://pricing.snapeda.com/search/part/TPS5430DDAR/?ref=eda; Availability: In Stock; SnapEDA_Link: https://www.snapeda.com/parts/TPS5430DDAR/Texas+Instruments/view-part/?ref=snap; MP: TPS5430DDAR; Price: None
U28 U29 = LM1117MP-3.3/NOPB: 800-mA 15-V linear voltage regulator; MF: Texas Instruments; SnapEDA_Link: https://www.snapeda.com/parts/LM1117MP-3.3/NOPB/Texas+Instruments/view-part/?ref=snap; Package: SOT-223-4 Texas Instruments; Value: *; MP: LM1117MP-3.3/NOPB; Check_prices: https://www.snapeda.com/parts/LM1117MP-3.3/NOPB/Texas+Instruments/view-part/?ref=eda

## Sheet POWER_MEASUREMENT.SchDoc
size 420 x 297 mm; SheetNumber: 6; SheetTotal: 32
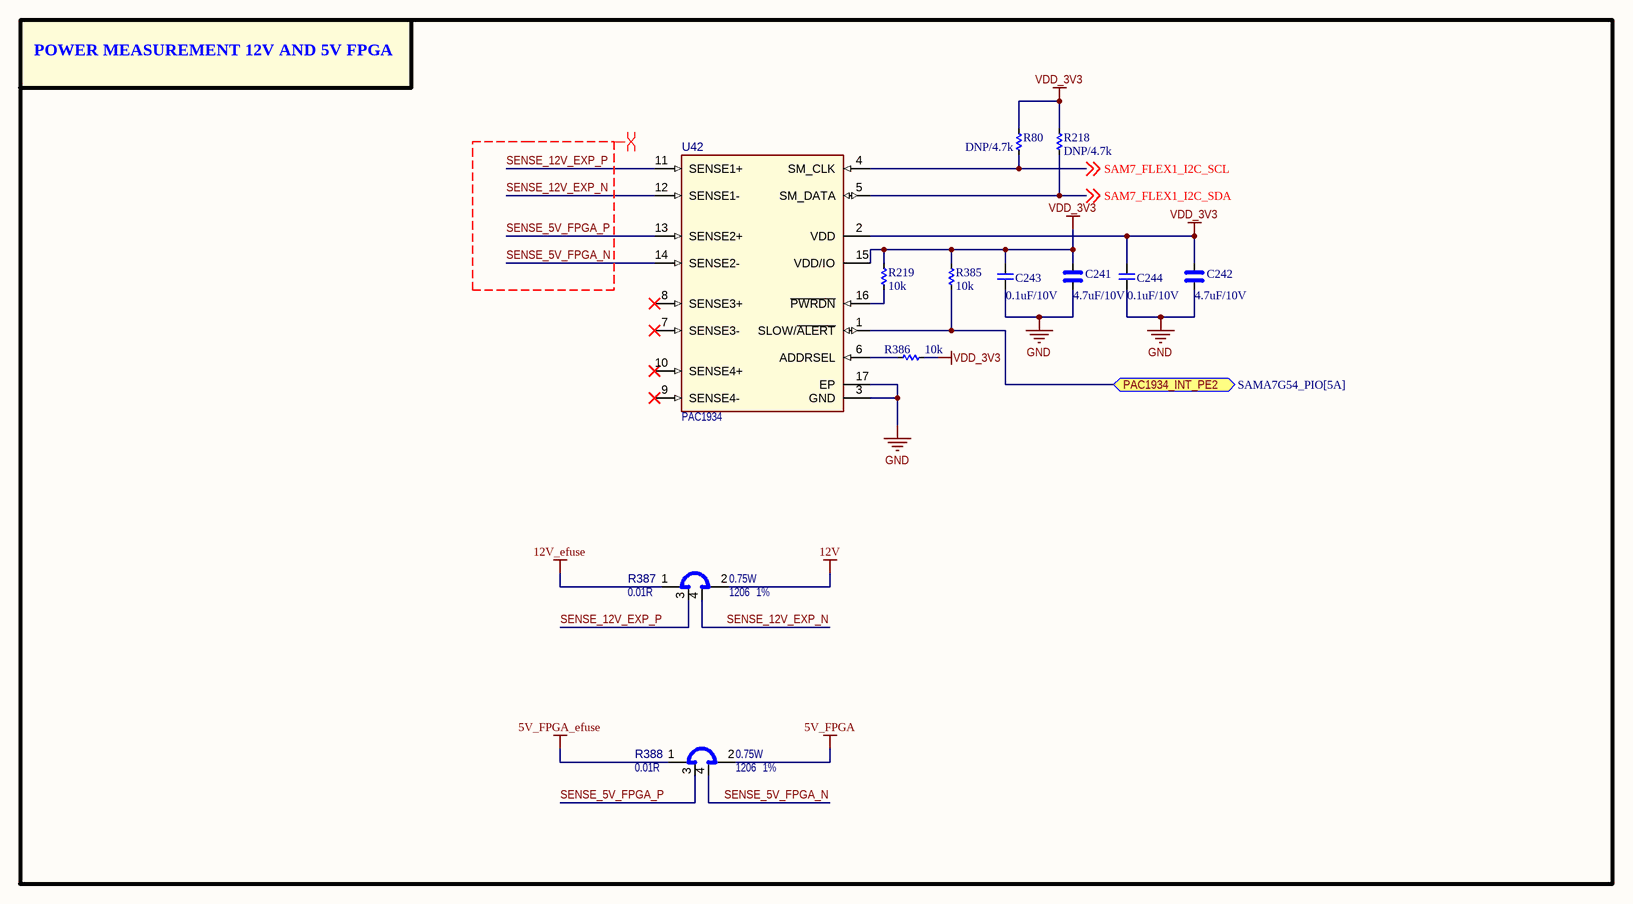
[diagram p5: POWER_MEASUREMENT.SchDoc]

### Parts
(Parts that share a designator on the sheet are numbered #1, #2 ... from top to bottom, then left to right.)
C241  4.7uF/10V  [CAP_C_1005X50_L]
C242  4.7uF/10V  [CAP_C_1005X50_L]
C243  0.1uF/10V  [CAP_C_1005X50_L]
C244  0.1uF/10V  [CAP_C_1005X50_L]
R80#1  DNP/4.7k  [RES_C_1005x30_L]
R218#1  DNP/4.7k  [RES_C_1005x30_L]
R219#1  10k  [RES_C_1005x30_L]
R385  10k  [RES_C_1005x30_L]
R386  10k  [RES_C_1005x30_L]
R387  value 0.01R  Package: 1206  Tolerance: 1%  Power: 0.75W  [RES_C_1206_SHUNT]  (hidden comment: KRL1632E-M-R010-F-T5)
R388  value 0.01R  Package: 1206  Tolerance: 1%  Power: 0.75W  [RES_C_1206_SHUNT]  (hidden comment: KRL1632E-M-R010-F-T5)
U42  value PAC1934  [UQFN-16_4X4_EP2.6X2.6]  (hidden comment: PAC1934 UQFN-16)

### Blocks framed on the sheet
POWER MEASUREMENT 12V AND 5V FPGA: C241-C244 R80#1 R218#1 R219#1 R385-R388 U42

### Ports
PAC1934_INT_PE2 (bidir, see SAMA7G54_PIO[5A])

### Nets
5V_FPGA: R388.2
5V_FPGA_efuse: R388.1
12V: R387.2
12V_efuse: R387.1
GND: C241.2 C242.2 C243.2 C244.2 U42.3(GND) U42.17(EP)
VDD_3V3: C241.1 C242.1 C243.1 C244.1 R80#1.1 R218#1.1 R219#1.1 R385.1 R386.2 U42.2(VDD) U42.15(VDD/IO)
SAM7_FLEX1_I2C_SCL: R80#1.2 U42.4(SM_CLK) ; off-sheet SAM7_FLEX1_I2C_SCL  [project net SAM_RTC_I2C_SCL]
SAM7_FLEX1_I2C_SDA: R218#1.2 U42.5(SM_DATA) ; off-sheet SAM7_FLEX1_I2C_SDA  [project net SAM_RTC_I2C_SDA]
SENSE_5V_FPGA_N: R388.4 U42.14(SENSE2-)
SENSE_5V_FPGA_P: R388.3 U42.13(SENSE2+)
SENSE_12V_EXP_N: R387.4 U42.12(SENSE1-)
SENSE_12V_EXP_P: R387.3 U42.11(SENSE1+)
NetR219#1_2: R219#1.2 U42.16(~{PWRDN})
NetR385_2: R385.2 U42.1(SLOW/~{ALERT}) ; port PAC1934_INT_PE2
NetR386_1: R386.1 U42.6(ADDRSEL)

Not connected (* = marked no-connect by the designer): U42 7(SENSE3-)* 8(SENSE3+)* 9(SENSE4-)* 10(SENSE4+)*

### Layout directives
differential pair: SENSE_5V_FPGA_N, SENSE_5V_FPGA_P, SENSE_12V_EXP_N, SENSE_12V_EXP_P

### Notes on the sheet
- Project:
- Sub-system:
- Design by:
- Sheet title:
- Sheet
- A3
- of
- Checked by:
- Approved by:
- Revision:
- Document No:
- Size:
- Date:

### Library data of the parts
C241 C242 = _CAP_C_High_2: CAP
C243 C244 = _CAP_C_2: CAP
R80#1 R218#1 R219#1 R385 R386 = _RES_B_2: RES
R387 R388 = RSMT1316: Shunt; Manufacturer 1: SUSUMU; Description_: RES SHUNT MF 0.01R 1% 0.75W SMD 1206; Dev Tools Status: Design; Temperature Coeffcient: 50ppm/C; Current: 8A; Owner: Ciprian Abramov; Populated: YES; MCHP-ID: RSMT1316; Revision: 1; Symbol: Shunt 4 Pin; Status: MCL Design; ComponentLink1URL: https://chn-vm-apps.microchip.com/mchprepo/parts/Datasheets/n_catalog_partition09_en.pdf; ComponentLink1Description: SVN Datasheet; ComponentLink2URL: C:\ALTIUM_WORK\00001_MCHP-CDB\Datasheets\n_catalog_partition09_en.pdf; ComponentLink2Description: Local Datasheet; ComponentLink3URL: C:\ALTIUM_WORK\00001_MCHP-CDB\Library\LibraryRefs\Shunt 4 Pin.SchLib; ComponentLink3Description: Open Symbol; ComponentLink4URL: C:\ALTIUM_WORK\00001_MCHP-CDB\Library\Footprints\RES_C_1206_SHUNT.PcbLib; ComponentLink4Description: Open Footprint; ComponentLink5Description: Open Footprint 2; ComponentLink6Description: Open Footprint 3; ComponentLink7Description: Open Footprint 4; Operating Temperature: -55C to +155C; Category: Resistor; Type: RES SMD; Composition: MF; Manufacturer Part Number 1: KRL1632E-M-R010-F-T5; Supplier 1: Digi-Key; Supplier Part Number 1: 408-1570-1-ND; Quantity Override: 1
U42 = MIC8883: Manufacturer 1: Microchip Technology; Manufacturer Part Number 1: PAC1934T-I/JQ; Description_: MCHP ANALOG POWER CURRENT SENSE MONITOR PAC1934T-I/JQ UQFN-16; Dev Tools Status: Design; Owner: Ciprian Abramov; Populated: YES; MCHP-ID: MIC8883; Symbol: PAC1934 UQFN-16; Type: Power/Current Sensor; Status: MCL Design; Revision: 1; Category: MCHP-Analog; ComponentLink1Description: SVN Datasheet; ComponentLink2Description: Local Datasheet; ComponentLink3URL: C:\ALTIUM_WORK\00001_MCHP-CDB\Library\LibraryRefs\PAC1934 UQFN-16.SchLib; ComponentLink3Description: Open Symbol; ComponentLink4URL: C:\ALTIUM_WORK\00001_MCHP-CDB\Library\Footprints\UQFN-16_4X4_EP2.6X2.6.PcbLib; ComponentLink4Description: Open Footprint; ComponentLink5Description: Open Footprint 2; ComponentLink6Description: Open Footprint 3; ComponentLink7Description: Open Footprint 4; Supplier 1: Digi-Key; Supplier Part Number 1: PAC1934T-I/JQCT-ND; Quantity Override: 1

## Sheet CONNECTOR_EXP.SchDoc
size 420 x 297 mm; SheetNumber: 7; SheetTotal: 32
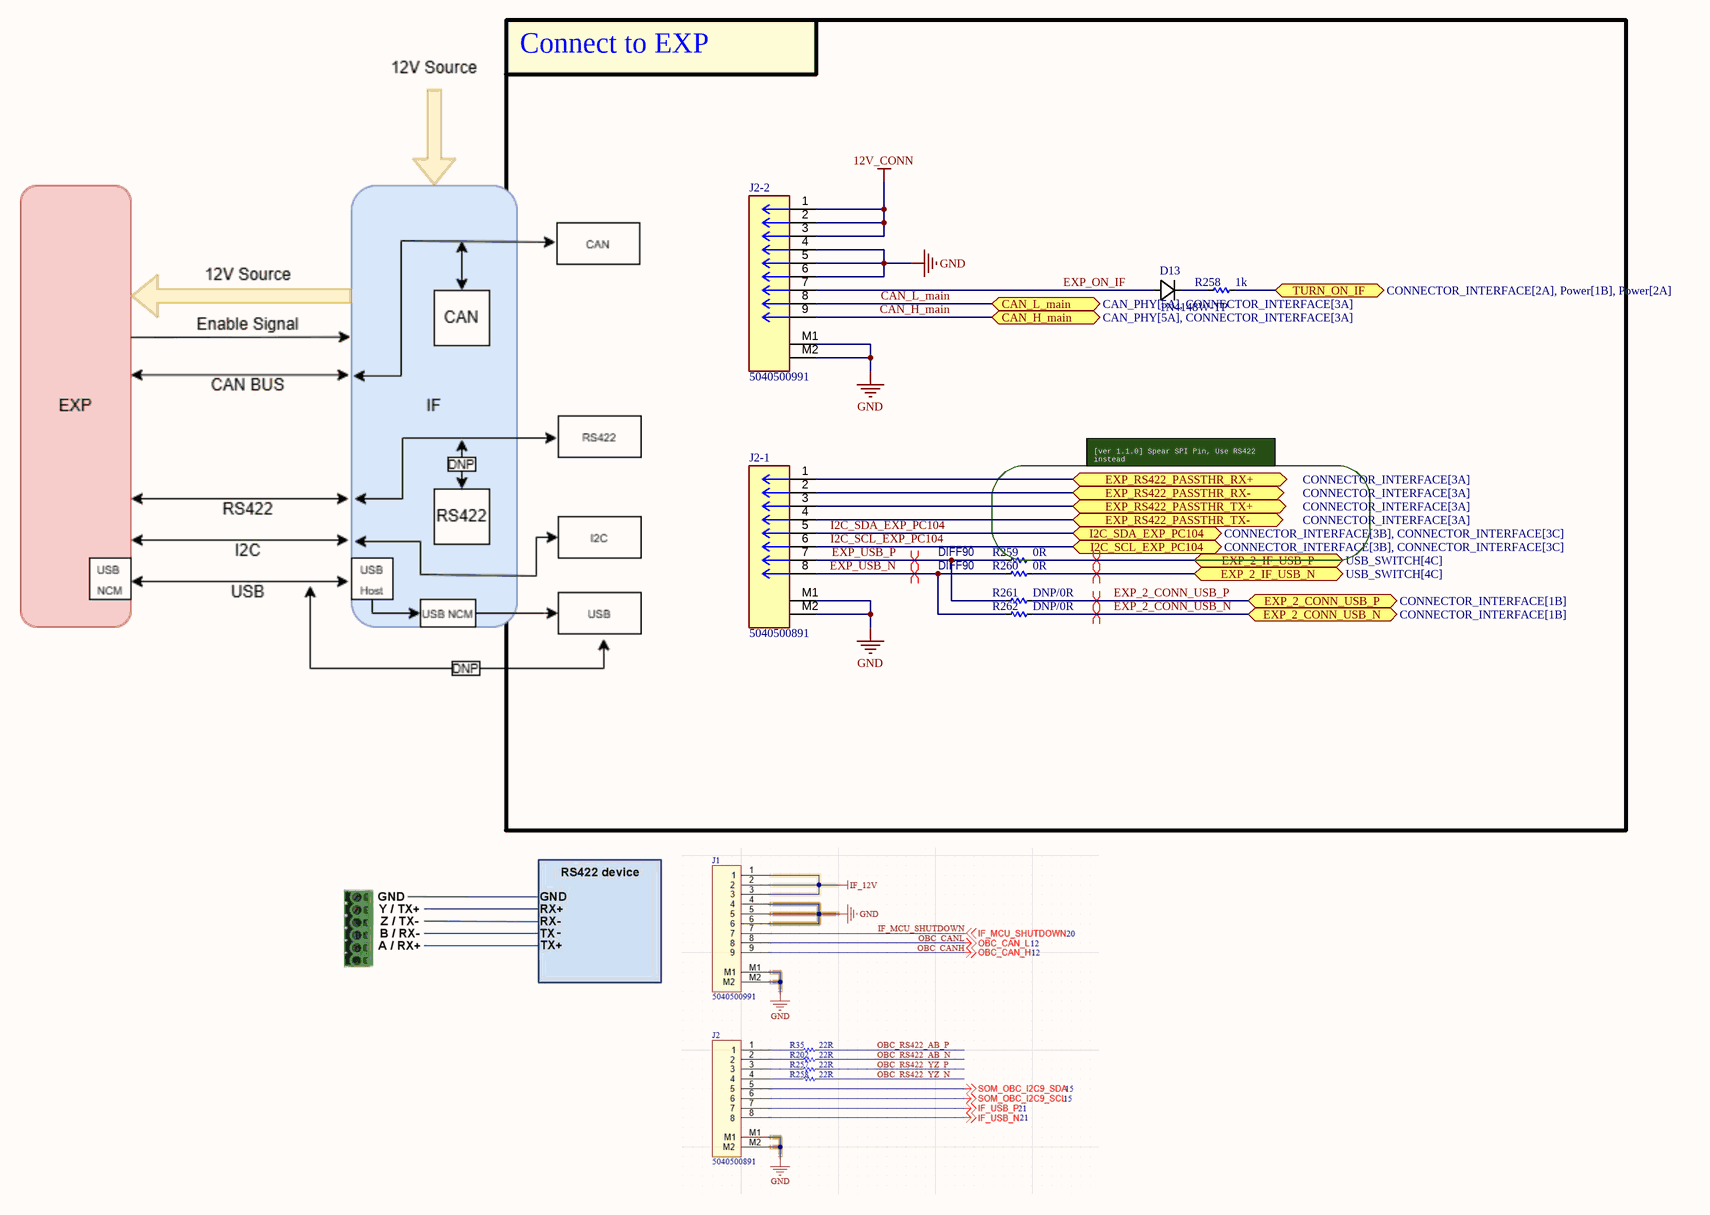
[diagram p6: CONNECTOR_EXP.SchDoc]

### Parts
D13  1N4148W-TP  [SOD123_MCC]
J2-1  5040500891  [MOLEX_5040500891]
J2-2  5040500991  [MOLEX_5040500991]
R258  1k  [RES_C_1005x30_L]
R259  0R  [RES_C_1005x30_L]
R260  0R  [RES_C_1005x30_L]
R261  DNP/0R  [RES_C_1005x30_L]
R262  DNP/0R  [RES_C_1005x30_L]

### Blocks framed on the sheet
Connect to EXP: D13 J2-1 J2-2 R258-R262

### Ports
CAN_H_main (bidir, see CAN_PHY[5A], CONNECTOR_INTERFACE[3A]), CAN_L_main (bidir, see CAN_PHY[5A], CONNECTOR_INTERFACE[3A]), EXP_2_CONN_USB_N (bidir, see CONNECTOR_INTERFACE[1B]), EXP_2_CONN_USB_P (bidir, see CONNECTOR_INTERFACE[1B]), EXP_2_IF_USB_N (bidir, see USB_SWITCH[4C]), EXP_2_IF_USB_P (bidir, see USB_SWITCH[4C]), EXP_RS422_PASSTHR_RX+ (bidir, see CONNECTOR_INTERFACE[3A]), EXP_RS422_PASSTHR_RX- (bidir, see CONNECTOR_INTERFACE[3A]), EXP_RS422_PASSTHR_TX+ (bidir, see CONNECTOR_INTERFACE[3A]), EXP_RS422_PASSTHR_TX- (bidir, see CONNECTOR_INTERFACE[3A]), I2C_SCL_EXP_PC104 (bidir, see CONNECTOR_INTERFACE[3B], CONNECTOR_INTERFACE[3C]), I2C_SDA_EXP_PC104 (bidir, see CONNECTOR_INTERFACE[3B], CONNECTOR_INTERFACE[3C]), TURN_ON_IF (bidir, see CONNECTOR_INTERFACE[2A], Power[1B], Power[2A])

### Nets
12V_CONN: J2-2.1 J2-2.2 J2-2.3
GND: J2-1.M1 J2-1.M2 J2-2.4 J2-2.5 J2-2.6 J2-2.M1 J2-2.M2
CAN_H_main: J2-2.9 ; port CAN_H_main
CAN_L_main: J2-2.8 ; port CAN_L_main
EXP_2_CONN_USB_N: R262.2 ; port EXP_2_CONN_USB_N
EXP_2_CONN_USB_P: R261.2 ; port EXP_2_CONN_USB_P
EXP_2_IF_USB_N: R260.2 ; port EXP_2_IF_USB_N
EXP_2_IF_USB_P: R259.2 ; port EXP_2_IF_USB_P
EXP_ON_IF: D13.2 J2-2.7
EXP_USB_N: J2-1.8 R260.1 R262.1
EXP_USB_P: J2-1.7 R259.1 R261.1
I2C_SCL_EXP_PC104: J2-1.6 ; port I2C_SCL_EXP_PC104
I2C_SDA_EXP_PC104: J2-1.5 ; port I2C_SDA_EXP_PC104
RS_422_2_PC104_RX_N: J2-1.2 ; port EXP_RS422_PASSTHR_RX-
RS_422_2_PC104_RX_P: J2-1.1 ; port EXP_RS422_PASSTHR_RX+
RS_422_2_PC104_TX_N: J2-1.4 ; port EXP_RS422_PASSTHR_TX-
RS_422_2_PC104_TX_P: J2-1.3 ; port EXP_RS422_PASSTHR_TX+
NetD8_1: R258.2 ; port TURN_ON_IF
NetD13_1: D13.1 R258.1

### Layout directives
differential pair; differential pair class DIFF90; net class DIFF90; rule Matched Net Lengths [Tolerance = 4mil]: EXP_2_CONN_USB_N, EXP_2_CONN_USB_P, EXP_2_IF_USB_N, EXP_2_IF_USB_P, EXP_USB_N, EXP_USB_P

### Notes on the sheet
- [ver 1.1.0] Spear SPI Pin, Use RS422 instead
- Project:
- Sub-system:
- Design by:
- Sheet title:
- Sheet
- A3
- of
- Checked by:
- Approved by:
- Revision:
- Document No:
- Size:
- Date:

### Library data of the parts
D13 = 1N4148W-TP: Description; Manufacturer_Name: MCC; Copyright: Copyright (C) 2026 Ultra Librarian. All rights reserved.; Manufacturer_Part_Number: 1N4148W-TP
J2-1 = 5040500891: Connector Header Surface Mount, Right Angle 8 position 0.059" (1.50mm)`
J2-2 = 5040500991: Connector Header Surface Mount, Right Angle 9 position 0.059" (1.50mm)
R258-R262 = _RES_B_2: RES

## Sheet CONNECTOR_INTERFACE.SchDoc
size 420 x 297 mm; SheetNumber: 8; SheetTotal: 32
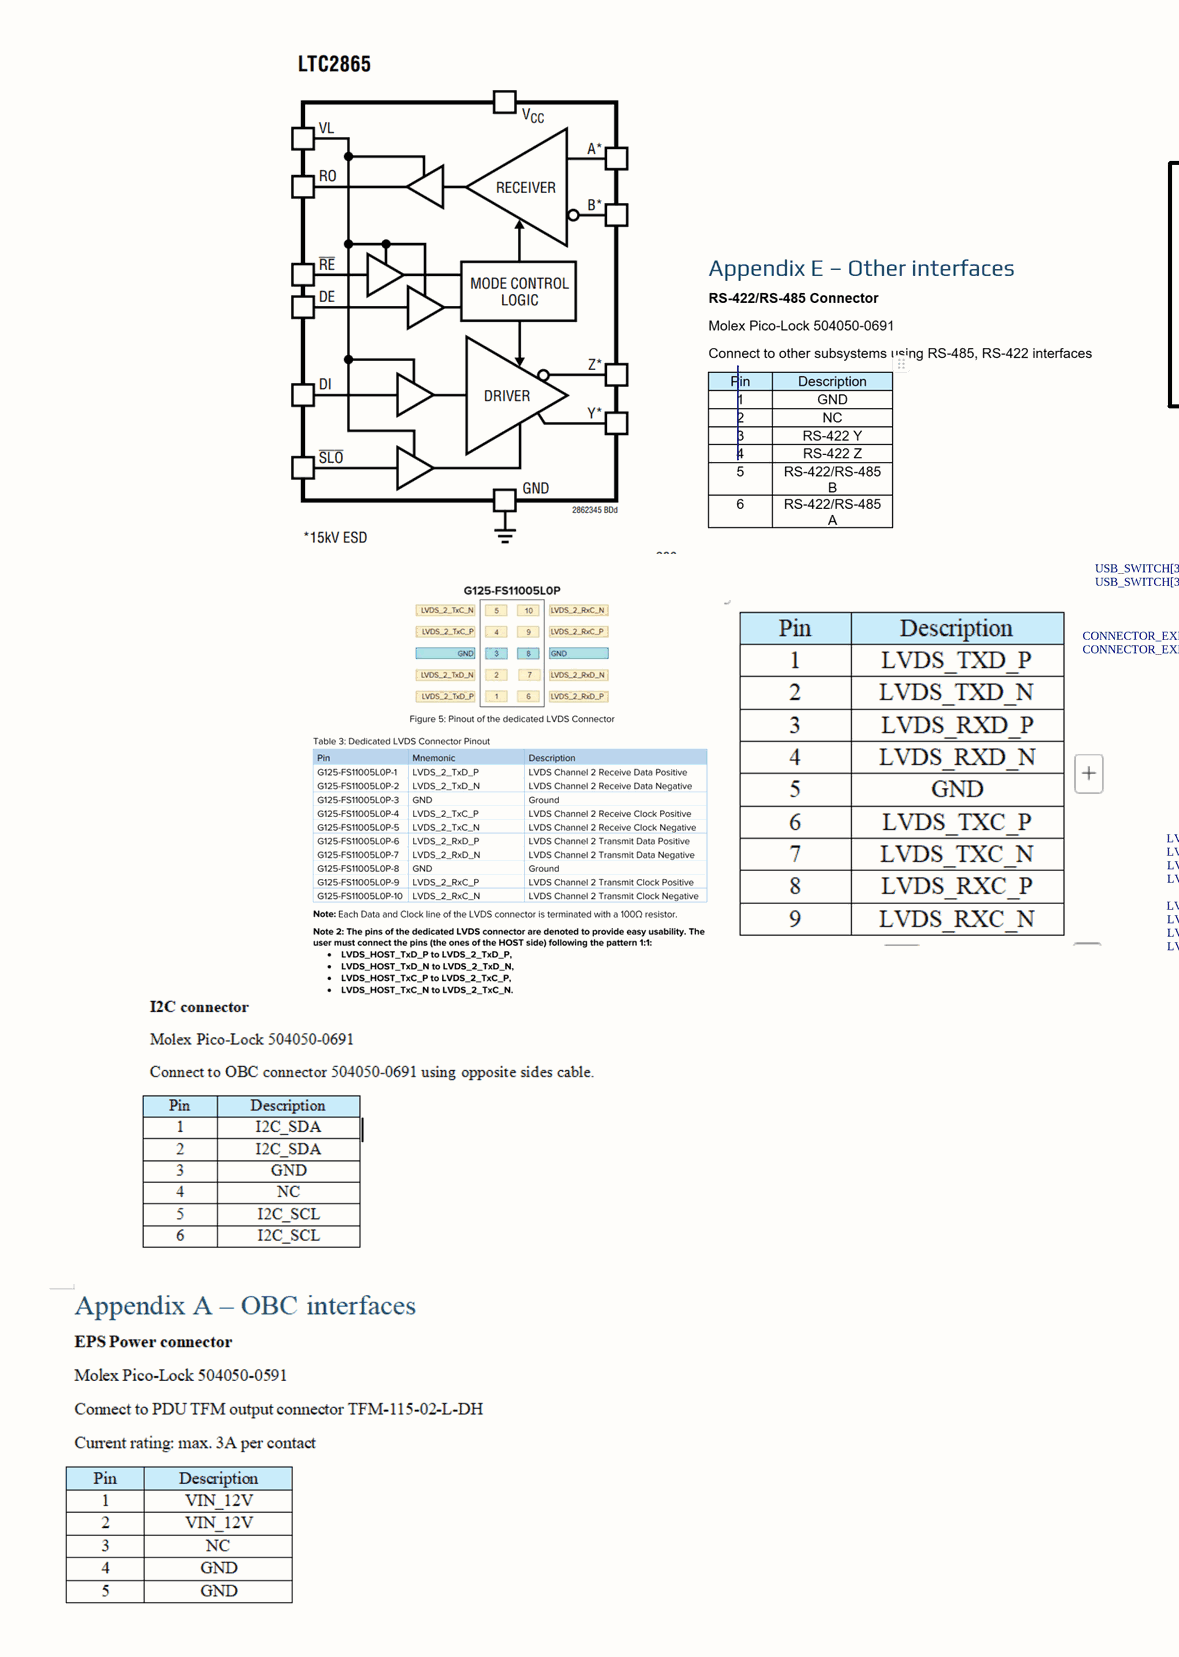
[diagram p7: CONNECTOR_INTERFACE.SchDoc, left]
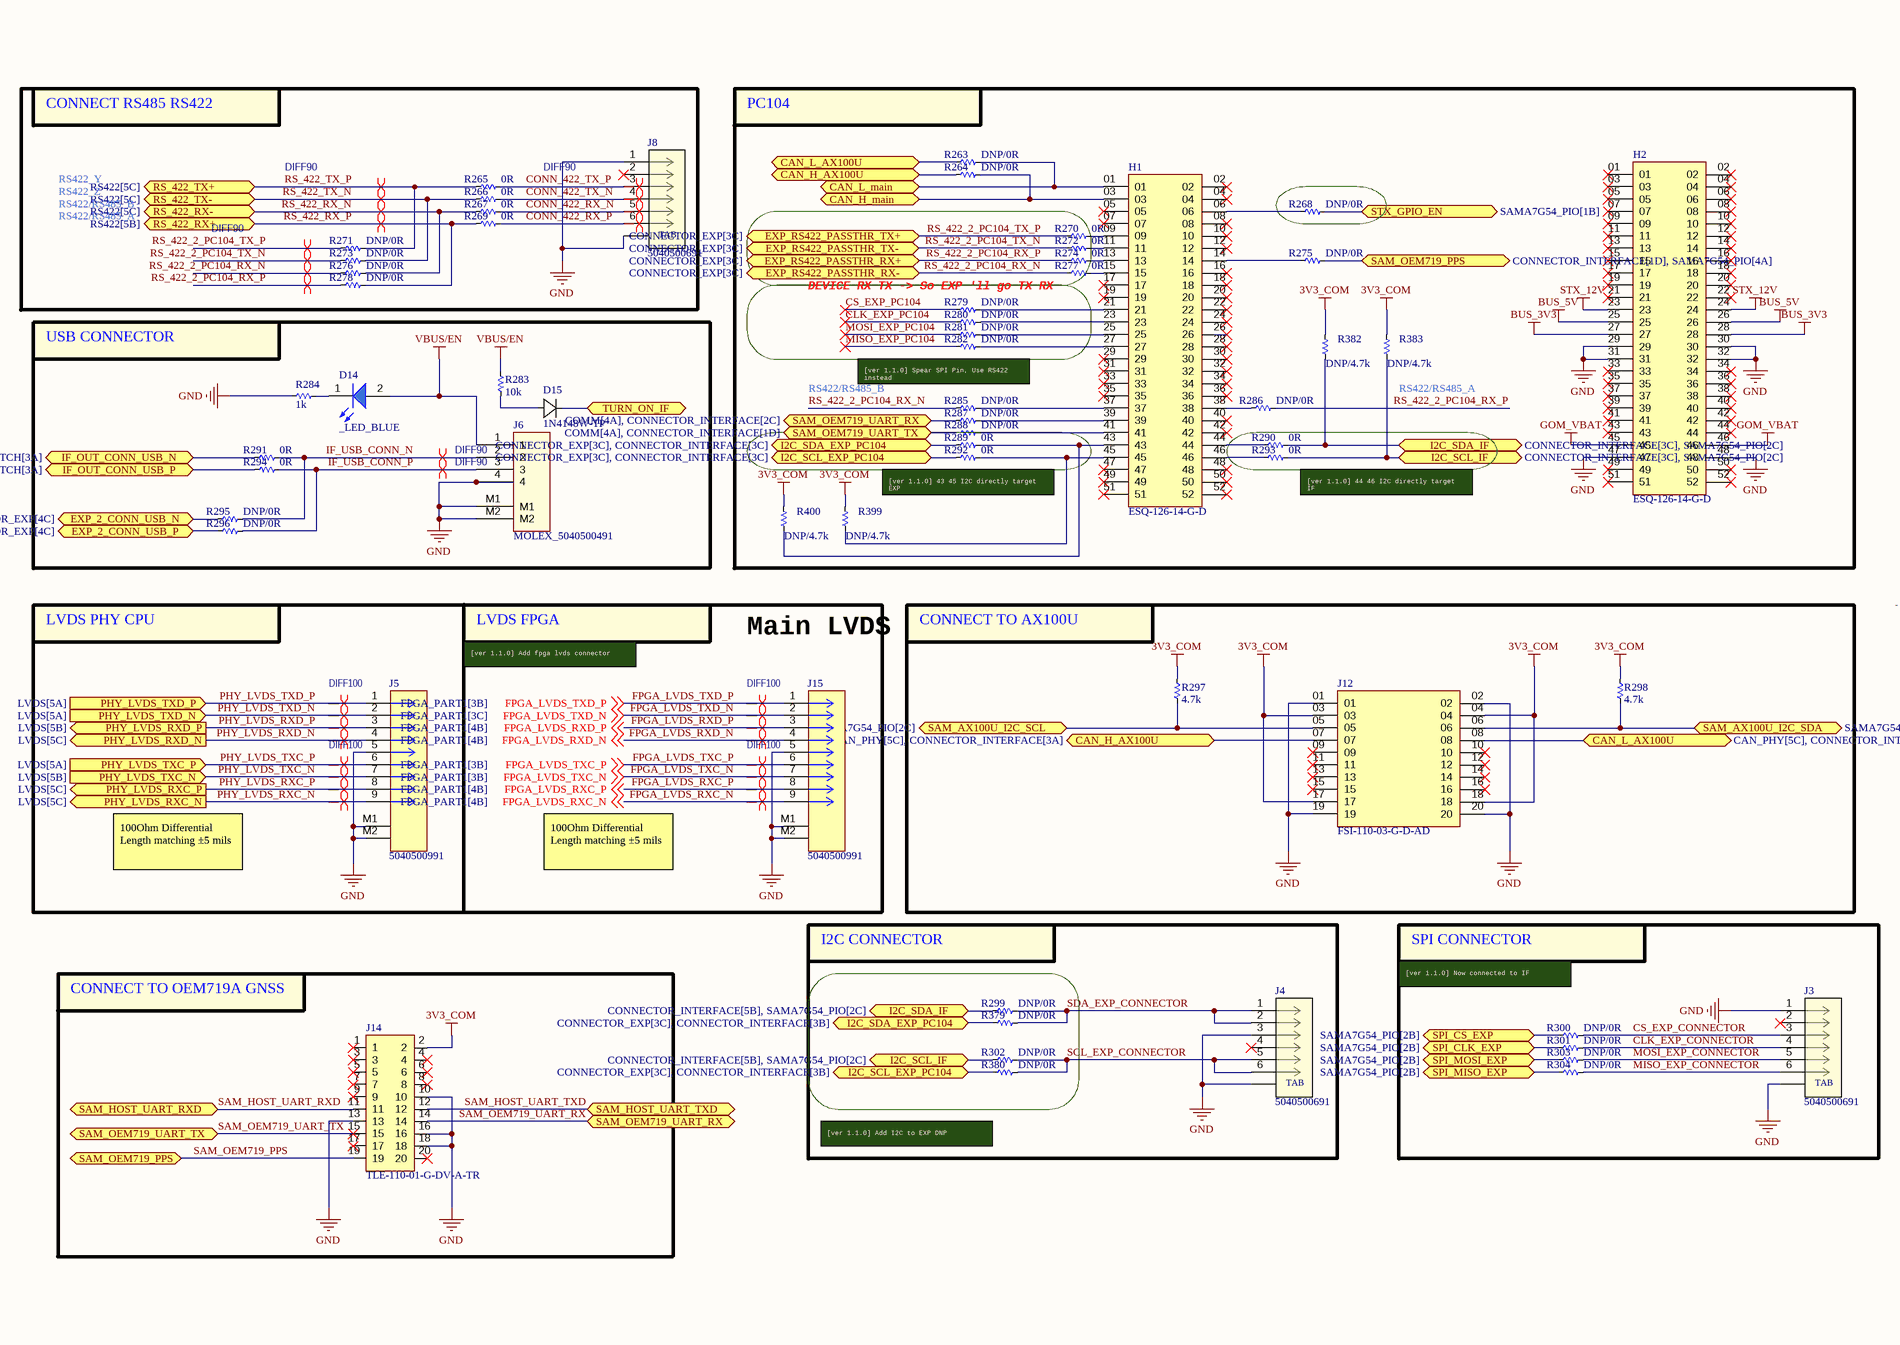
[diagram p8: CONNECTOR_INTERFACE.SchDoc, middle]
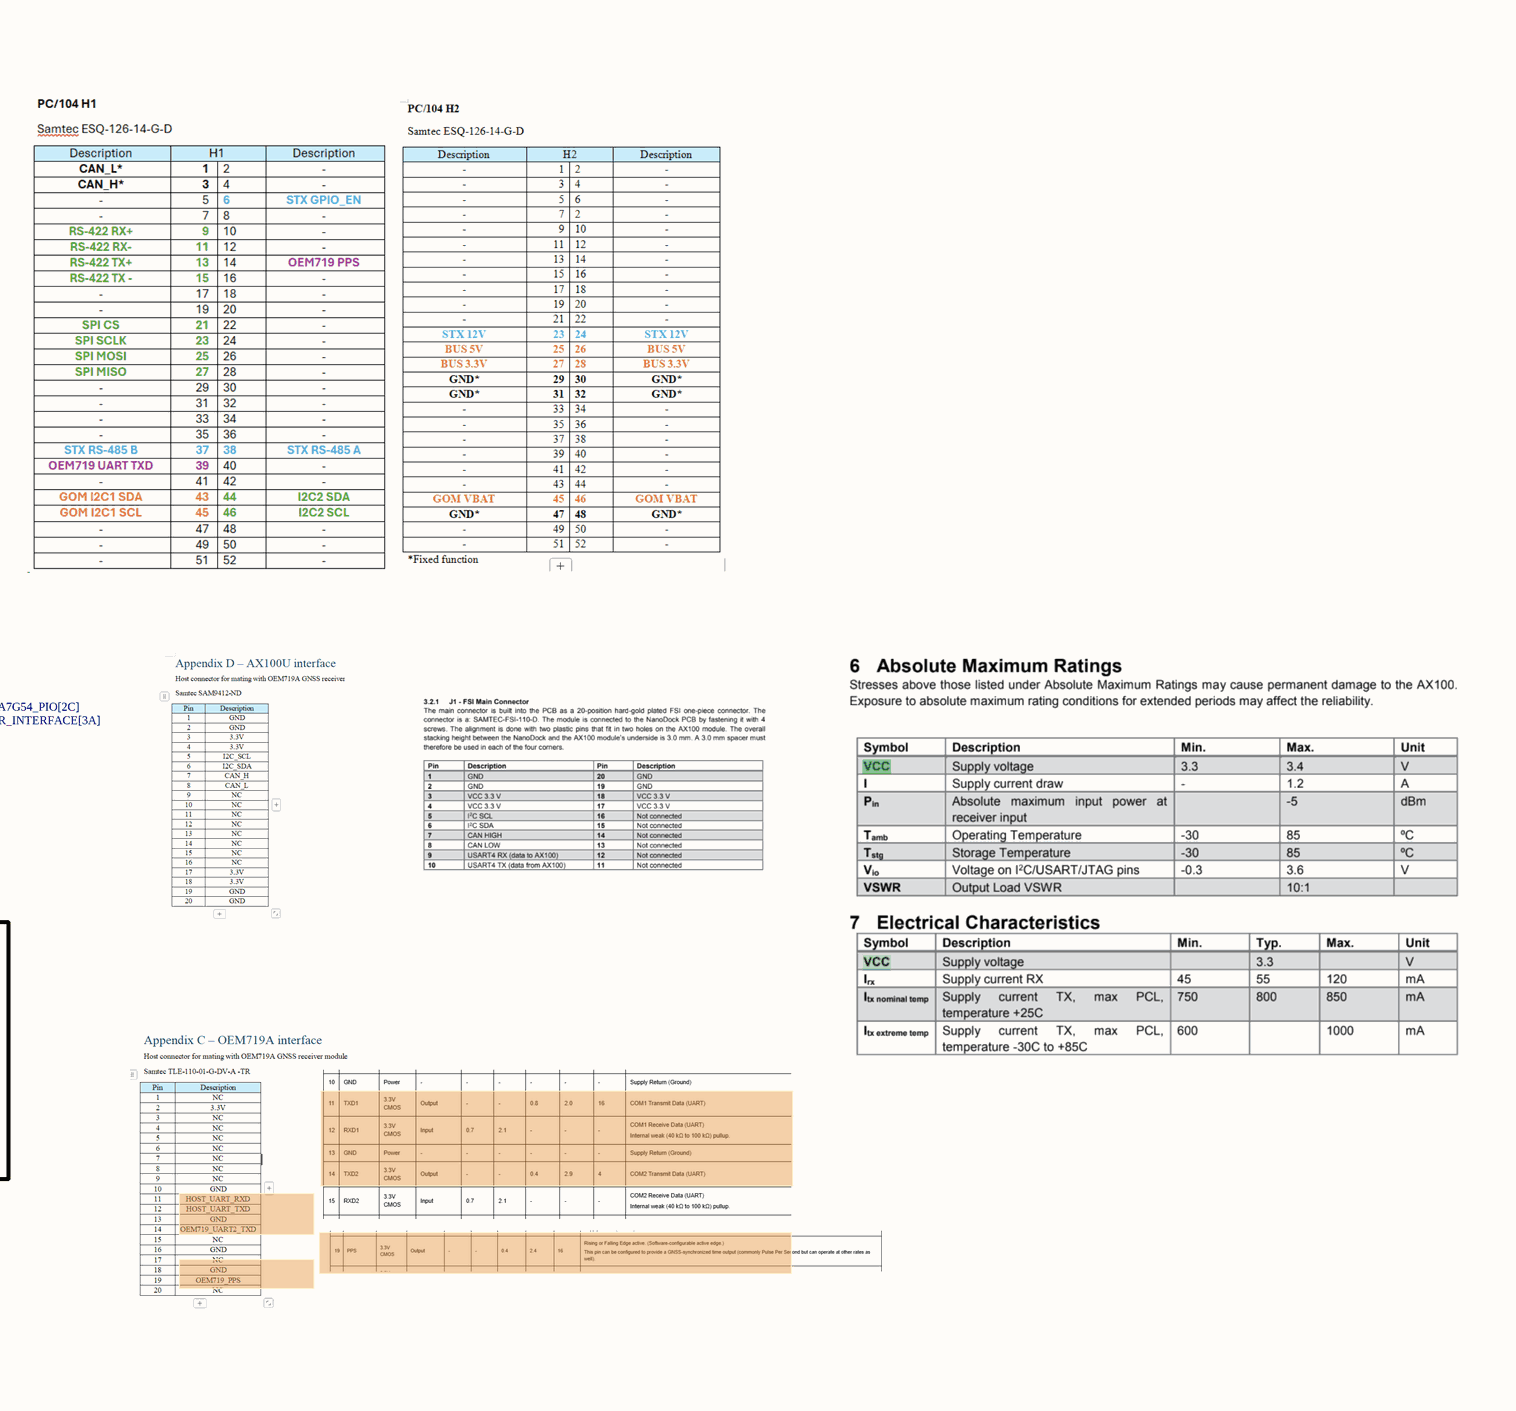
[diagram p9: CONNECTOR_INTERFACE.SchDoc, right]

### Parts
(Parts that share a designator on the sheet are numbered #1, #2 ... from top to bottom, then left to right.)
D14  _LED_BLUE  [LED_0603]
D15  1N4148W-TP  [SOD123_MCC]
H1  ESQ-126-14-G-D  [SAMTEC_ESQ-126-14-G-D]
H2  ESQ-126-14-G-D  [SAMTEC_ESQ-126-14-G-D]
J3  5040500691  [5040500691]
J4  5040500691  [5040500691]
J5  5040500991  [MOLEX_5040500991]
J6  MOLEX_5040500491  [MOLEX_5040500491]
J8  5040500691  [5040500691]
J12  FSI-110-03-G-D-AD  [SAMTEC_FSI-110-03-X-D-AD-TR]
J14#1  TLE-110-01-G-DV-A-TR  [SAMTEC-TLE-110-01-X-DV-A]
J15  5040500991  [MOLEX_5040500991]
R263  DNP/0R  [RES_C_1005x30_L]
R264  DNP/0R  [RES_C_1005x30_L]
R265  0R  [RES_C_1005x30_L]
R266  0R  [RES_C_1005x30_L]
R267  0R  [RES_C_1005x30_L]
R268  DNP/0R  [RES_C_1005x30_L]
R269  0R  [RES_C_1005x30_L]
R270  0R  [RES_C_1005x30_L]
R271  DNP/0R  [RES_C_1005x30_L]
R272  0R  [RES_C_1005x30_L]
R273  DNP/0R  [RES_C_1005x30_L]
R274  0R  [RES_C_1005x30_L]
R275  DNP/0R  [RES_C_1005x30_L]
R276  DNP/0R  [RES_C_1005x30_L]
R277  0R  [RES_C_1005x30_L]
R278  DNP/0R  [RES_C_1005x30_L]
R279  DNP/0R  [RES_C_1005x30_L]
R280  DNP/0R  [RES_C_1005x30_L]
R281  DNP/0R  [RES_C_1005x30_L]
R282  DNP/0R  [RES_C_1005x30_L]
R283  10k  [RES_C_1005x30_L]
R284  1k  [RES_C_1005x30_L]
R285  DNP/0R  [RES_C_1005x30_L]
R286  DNP/0R  [RES_C_1005x30_L]
R287  DNP/0R  [RES_C_1005x30_L]
R288  DNP/0R  [RES_C_1005x30_L]
R289  0R  [RES_C_1005x30_L]
R290  0R  [RES_C_1005x30_L]
R291  0R  [RES_C_1005x30_L]
R292  0R  [RES_C_1005x30_L]
R293  0R  [RES_C_1005x30_L]
R294  0R  [RES_C_1005x30_L]
R295  DNP/0R  [RES_C_1005x30_L]
R296  DNP/0R  [RES_C_1005x30_L]
R297  4.7k  [RES_C_1005x30_L]
R298  4.7k  [RES_C_1005x30_L]
R299  DNP/0R  [RES_C_1005x30_L]
R300  DNP/0R  [RES_C_1005x30_L]
R301  DNP/0R  [RES_C_1005x30_L]
R302  DNP/0R  [RES_C_1005x30_L]
R303  DNP/0R  [RES_C_1005x30_L]
R304  DNP/0R  [RES_C_1005x30_L]
R379  DNP/0R  [RES_C_1005x30_L]
R380  DNP/0R  [RES_C_1005x30_L]
R382  DNP/4.7k  [RES_C_1005x30_L]
R383  DNP/4.7k  [RES_C_1005x30_L]
R399  DNP/4.7k  [RES_C_1005x30_L]
R400  DNP/4.7k  [RES_C_1005x30_L]

### Blocks framed on the sheet
CONNECT RS485 RS422: J8 R265-R267 R269 R271 R273 R276 R278
PC104: H1 H2 R263 R264 R268 R275 R279-R282 R285-R290 R292 R293 R382 R383 R399 R400
DEVICE RX TX -> So EXP 'll go TX RX: R270 R272 R274 R277
USB CONNECTOR: D14 D15 J6 R283 R284 R291 R294-R296
Main LVDS: J5 J15
CONNECT TO AX100U: J12 R297 R298
I2C CONNECTOR: J4 R299 R302 R379 R380
SPI CONNECTOR: J3 R300 R301 R303 R304
CONNECT TO OEM719A GNSS: J14#1

### Ports
CAN_H_AX100U (bidir, see CAN_PHY[5C], CONNECTOR_INTERFACE[3A]), CAN_H_AX100U (bidir, see CAN_PHY[5C], CONNECTOR_INTERFACE[4B]), CAN_H_main (bidir, see CAN_PHY[5A], CONNECTOR_EXP[3B]), CAN_L_AX100U (bidir, see CAN_PHY[5C], CONNECTOR_INTERFACE[3A]), CAN_L_AX100U (bidir, see CAN_PHY[5C], CONNECTOR_INTERFACE[5B]), CAN_L_main (bidir, see CAN_PHY[5A], CONNECTOR_EXP[3B]), EXP_2_CONN_USB_N (bidir, see CONNECTOR_EXP[4C]), EXP_2_CONN_USB_P (bidir, see CONNECTOR_EXP[4C]), EXP_RS422_PASSTHR_RX+ (bidir, see CONNECTOR_EXP[3C]), EXP_RS422_PASSTHR_RX- (bidir, see CONNECTOR_EXP[3C]), EXP_RS422_PASSTHR_TX+ (bidir, see CONNECTOR_EXP[3C]), EXP_RS422_PASSTHR_TX- (bidir, see CONNECTOR_EXP[3C]), I2C_SCL_EXP_PC104 (bidir, see CONNECTOR_EXP[3C], CONNECTOR_INTERFACE[3B]), I2C_SCL_EXP_PC104 (bidir, see CONNECTOR_EXP[3C], CONNECTOR_INTERFACE[3C]), I2C_SCL_IF (bidir, see CONNECTOR_INTERFACE[3C], SAMA7G54_PIO[2C]), I2C_SCL_IF (bidir, see CONNECTOR_INTERFACE[5B], SAMA7G54_PIO[2C]), I2C_SDA_EXP_PC104 (bidir, see CONNECTOR_EXP[3C], CONNECTOR_INTERFACE[3B]), I2C_SDA_EXP_PC104 (bidir, see CONNECTOR_EXP[3C], CONNECTOR_INTERFACE[3C]), I2C_SDA_IF (bidir, see CONNECTOR_INTERFACE[3C], SAMA7G54_PIO[2C]), I2C_SDA_IF (bidir, see CONNECTOR_INTERFACE[5B], SAMA7G54_PIO[2C]), IF_OUT_CONN_USB_N (bidir, see USB_SWITCH[3A]), IF_OUT_CONN_USB_P (bidir, see USB_SWITCH[3A]), PHY_LVDS_RXC_N (out, see LVDS[5C]), PHY_LVDS_RXC_P (out, see LVDS[5C]), PHY_LVDS_RXD_N (out, see LVDS[5C]), PHY_LVDS_RXD_P (out, see LVDS[5B]), PHY_LVDS_TXC_N (in, see LVDS[5B]), PHY_LVDS_TXC_P (in, see LVDS[5A]), PHY_LVDS_TXD_N (in, see LVDS[5A]), PHY_LVDS_TXD_P (in, see LVDS[5A]), RS_422_RX+ (bidir, see RS422[5B]), RS_422_RX- (bidir, see RS422[5C]), RS_422_TX+ (bidir, see RS422[5C]), RS_422_TX- (bidir, see RS422[5C]), SAM_AX100U_I2C_SCL (bidir, see SAMA7G54_PIO[2C]), SAM_AX100U_I2C_SDA (bidir, see SAMA7G54_PIO[2C]), SAM_HOST_UART_RXD (bidir, see COMM[4A]), SAM_HOST_UART_TXD (bidir, see COMM[4A]), SAM_OEM719_PPS (bidir, see CONNECTOR_INTERFACE[1D], SAMA7G54_PIO[4A]), SAM_OEM719_PPS (bidir, see CONNECTOR_INTERFACE[5A], SAMA7G54_PIO[4A]), SAM_OEM719_UART_RX (bidir, see COMM[4A], CONNECTOR_INTERFACE[2C]), SAM_OEM719_UART_RX (bidir, see COMM[4A], CONNECTOR_INTERFACE[3B]), SAM_OEM719_UART_TX (bidir, see COMM[4A], CONNECTOR_INTERFACE[1D]), SAM_OEM719_UART_TX (bidir, see COMM[4A], CONNECTOR_INTERFACE[3B]), SPI_CLK_EXP (bidir, see SAMA7G54_PIO[2B]), SPI_CS_EXP (bidir, see SAMA7G54_PIO[2B]), SPI_MISO_EXP (bidir, see SAMA7G54_PIO[2B]), SPI_MOSI_EXP (bidir, see SAMA7G54_PIO[2B]), STX_GPIO_EN (bidir, see SAMA7G54_PIO[1B]), TURN_ON_IF (bidir, see CONNECTOR_EXP[4B], Power[1B], Power[2A])

### Nets
3V3_COM: J12.03 J12.04 J12.17 J12.18 J14#1.2 R297.2 R298.2 R382.2 R383.2 R399.2 R400.2
BUS_3V3: H2.27 H2.28
BUS_5V: H2.25 H2.26
GND: H2.29 H2.30 H2.31 H2.32 H2.47 H2.48 J3.1 J3.7 J4.3 J4.7 J5.5 J5.M1 J5.M2 J6.4 J6.M1 J6.M2 J8.1 J8.7 J12.01 J12.02 J12.19 J12.20 J14#1.10 J14#1.13 J14#1.16 J14#1.18 J15.5 J15.M1 J15.M2 R284.1
GOM_VBAT: H2.45 H2.46
STX_12V: H2.23 H2.24
VBUS/EN: D14.2(A) J6.1 R283.1
CAN_AX_H: J12.07 R264.1 ; port CAN_H_AX100U
CAN_AX_L: J12.08 R263.1 ; port CAN_L_AX100U
CAN_H_main: H1.03 R264.2 ; port CAN_H_main
CAN_L_main: H1.01 R263.2 ; port CAN_L_main
CLK_EXP_CONNECTOR: J3.4 R301.2
CLK_EXP_PC104: R280.1
CONN_422_RX_N: J8.5 R267.2
CONN_422_RX_P: J8.6 R269.2
CONN_422_TX_N: J8.4 R266.2
CONN_422_TX_P: J8.3 R265.2
CS_EXP_CONNECTOR: J3.3 R300.2
CS_EXP_PC104: R279.1
EXP_2_CONN_USB_N: R295.1 ; port EXP_2_CONN_USB_N
EXP_2_CONN_USB_P: R296.1 ; port EXP_2_CONN_USB_P
FPGA_LVDS_RXC_N: J15.9 ; off-sheet FPGA_LVDS_RXC_N
FPGA_LVDS_RXC_P: J15.8 ; off-sheet FPGA_LVDS_RXC_P
FPGA_LVDS_RXD_N: J15.4 ; off-sheet FPGA_LVDS_RXD_N
FPGA_LVDS_RXD_P: J15.3 ; off-sheet FPGA_LVDS_RXD_P
FPGA_LVDS_TXC_N: J15.7 ; off-sheet FPGA_LVDS_TXC_N
FPGA_LVDS_TXC_P: J15.6 ; off-sheet FPGA_LVDS_TXC_P
FPGA_LVDS_TXD_N: J15.2 ; off-sheet FPGA_LVDS_TXD_N
FPGA_LVDS_TXD_P: J15.1 ; off-sheet FPGA_LVDS_TXD_P
I2C_SCL_EXP_PC104: R292.1 R380.1 ; port I2C_SCL_EXP_PC104
I2C_SDA_EXP_PC104: R289.1 R379.1 ; port I2C_SDA_EXP_PC104
IF_OUT_CONN_USB_N: R291.1 ; port IF_OUT_CONN_USB_N
IF_OUT_CONN_USB_P: R294.1 ; port IF_OUT_CONN_USB_P
IF_USB_CONN_N: J6.2 R291.2 R295.2
IF_USB_CONN_P: J6.3 R294.2 R296.2
MISO_EXP_CONNECTOR: J3.6 R304.2
MISO_EXP_PC104: R282.1
MOSI_EXP_CONNECTOR: J3.5 R303.2
MOSI_EXP_PC104: R281.1
PHY_LVDS_RXC_N: J5.9 ; port PHY_LVDS_RXC_N
PHY_LVDS_RXC_P: J5.8 ; port PHY_LVDS_RXC_P
PHY_LVDS_RXD_N: J5.4 ; port PHY_LVDS_RXD_N
PHY_LVDS_RXD_P: J5.3 ; port PHY_LVDS_RXD_P
PHY_LVDS_TXC_N: J5.7 ; port PHY_LVDS_TXC_N
PHY_LVDS_TXC_P: J5.6 ; port PHY_LVDS_TXC_P
PHY_LVDS_TXD_N: J5.2 ; port PHY_LVDS_TXD_N
PHY_LVDS_TXD_P: J5.1 ; port PHY_LVDS_TXD_P
RS_422_2_PC104_RX_N: R276.1 R277.1 R285.1 ; port EXP_RS422_PASSTHR_RX-
RS_422_2_PC104_RX_P: R274.1 R278.1 R286.2 ; port EXP_RS422_PASSTHR_RX+
RS_422_2_PC104_TX_N: R272.1 R273.1 ; port EXP_RS422_PASSTHR_TX-
RS_422_2_PC104_TX_P: R270.1 R271.1 ; port EXP_RS422_PASSTHR_TX+
RS_422_RX_N: R267.1 R276.2 ; port RS_422_RX-
RS_422_RX_P: R269.1 R278.2 ; port RS_422_RX+
RS_422_TX_N: R266.1 R273.2 ; port RS_422_TX-
RS_422_TX_P: R265.1 R271.2 ; port RS_422_TX+
SAM_HOST_UART_RXD: J14#1.11 ; port SAM_HOST_UART_RXD
SAM_HOST_UART_TXD: J14#1.12 ; port SAM_HOST_UART_TXD
SAM_OEM719_PPS: J14#1.19 R275.2 ; port SAM_OEM719_PPS
SAM_OEM719_UART_RX: J14#1.14 R287.1 ; port SAM_OEM719_UART_RX
SAM_OEM719_UART_TX: J14#1.15 R288.1 ; port SAM_OEM719_UART_TX
SCL_EXP_CONNECTOR: J4.5 J4.6 R302.2 R380.2
SDA_EXP_CONNECTOR: J4.1 J4.2 R299.2 R379.2
NetD8_1: D15.1 ; port TURN_ON_IF
NetD14_1: D14.1(K) R284.2
NetD15_2: D15.2 R283.2
NetH1_06: H1.06 R268.1
NetH1_09: H1.09 R270.2
NetH1_11: H1.11 R272.2
NetH1_13: H1.13 R274.2
NetH1_14: H1.14 R275.1
NetH1_15: H1.15 R277.2
NetH1_21: H1.21 R279.2
NetH1_23: H1.23 R280.2
NetH1_25: H1.25 R281.2
NetH1_27: H1.27 R282.2
NetH1_37: H1.37 R285.2
NetH1_38: H1.38 R286.1
NetH1_39: H1.39 R287.2
NetH1_41: H1.41 R288.2
NetH1_43: H1.43 R289.2 R400.1
NetH1_44: H1.44 R290.1
NetH1_45: H1.45 R292.2 R399.1
NetH1_46: H1.46 R293.1
NetJ12_05: J12.05 R297.1 ; port SAM_AX100U_I2C_SCL
NetJ12_06: J12.06 R298.1 ; port SAM_AX100U_I2C_SDA
NetR91_1: R268.2 ; port STX_GPIO_EN
NetR95_1: R301.1 ; port SPI_CLK_EXP
NetR96_1: R300.1 ; port SPI_CS_EXP
NetR97_1: R303.1 ; port SPI_MOSI_EXP
NetR98_1: R304.1 ; port SPI_MISO_EXP
NetR140_1: R290.2 R299.1 R382.1 ; port I2C_SDA_IF
NetR142_1: R293.2 R302.1 R383.1 ; port I2C_SCL_IF

Not connected (* = marked no-connect by the designer): H1 02* 04* 05* 07* 08* 10* 12* 16* 17* 18* 19* 20* 22* 24* 26* 28* 29* 30* 31* 32* 33* 34* 35* 36* 40* 42* 47* 48* 49* 50* 51* 52*; H2 01* 02* 03* 04* 05* 06* 07* 08* 09* 10* 11* 12* 13* 14* 15* 16* 17* 18* 19* 20* 21* 22* 33* 34* 35* 36* 37* 38* 39* 40* 41* 42* 43* 44* 49* 50* 51* 52*; J3 2*; J4 4*; J8 2*; J12 09* 10* 11* 12* 13* 14* 15* 16*; J14#1 1* 3* 4* 5* 6* 7* 8* 9* 17* 20*

### Layout directives
differential pair; differential pair class DIFF90; net class DIFF90; rule Matched Net Lengths [Tolerance = 4mil]: CONN_422_RX_N, CONN_422_RX_P, CONN_422_TX_N, CONN_422_TX_P, IF_USB_CONN_N, IF_USB_CONN_P, RS_422_2_PC104_RX_N, RS_422_2_PC104_RX_P, RS_422_2_PC104_TX_N, RS_422_2_PC104_TX_P, RS_422_RX_N, RS_422_RX_P, RS_422_TX_N, RS_422_TX_P
differential pair; differential pair class DIFF100; net class DIFF100; rule Matched Net Lengths [Tolerance = 4mil]: FPGA_LVDS_RXC_N, FPGA_LVDS_RXC_P, FPGA_LVDS_RXD_N, FPGA_LVDS_RXD_P, FPGA_LVDS_TXC_N, FPGA_LVDS_TXC_P, FPGA_LVDS_TXD_N, FPGA_LVDS_TXD_P, PHY_LVDS_RXC_N, PHY_LVDS_RXC_P, PHY_LVDS_RXD_N, PHY_LVDS_RXD_P, PHY_LVDS_TXC_N, PHY_LVDS_TXC_P, PHY_LVDS_TXD_N, PHY_LVDS_TXD_P

### Notes on the sheet
- RS422/RS485_A
- RS422/RS485_B
- RS422_Z
- RS422_Y
- (near R282) [ver 1.1.0] Spear SPI Pin, Use RS422 instead
- (near R383) RS422/RS485_A
- (near R292) [ver 1.1.0] 43 45 I2C directly target EXP
- [ver 1.1.0] 44 46 I2C directly target IF
- LVDS PHY CPU
- LVDS FPGA
- [ver 1.1.0] Add fpga lvds connector
- 100Ohm Differential
  Length matching ±5 mils
- [ver 1.1.0] Now connected to IF
- [ver 1.1.0] Add I2C to EXP DNP
- Project:
- Sub-system:
- Design by:
- Sheet title:
- Sheet
- A3
- of
- Checked by:
- Approved by:
- Revision:
- Document No:
- Size:
- Date:
- (in symbol 5040500691) TAB

### Library data of the parts
D14 = LED_BLUE: LED BLUE CLEAR 0603 SMD
D15 = 1N4148W-TP: Description; Manufacturer_Name: MCC; Copyright: Copyright (C) 2026 Ultra Librarian. All rights reserved.; Manufacturer_Part_Number: 1N4148W-TP
H1 H2 = ESQ-126-14-G-D: CONN SOCKET 52POS 0.1 GOLD PCB; MF: Samtec; MP: ESQ-126-14-G-D; Price: None; Package: None; Value: *; Availability: Unavailable
J3 J4 J8 = 5040500691: 1.50mm Pitch, Pico-Lock PCB Header, Single Row, Right-Angle, Surface Mount, Gold (Au) Plating, Positive Lock, 6 Circuits, Tape and Reel; Manufacturer_Name: Molex Connector Corporation; Copyright: Copyright (C) 2025 Ultra Librarian. All rights reserved.; Manufacturer_Part_Number: 5040500691; Datasheet: https://www.molex.com/en-us/products/part-detail-pdf/5040500691?display=pdf; RefDes: RefDes; Type: Type
J5 J15 = 5040500991: as J2-2 on sheet CONNECTOR_EXP
J6 = Header 4x1_2M
J12 = FSI-110-03-X-D-AD-TR: CONN STACKING 20POS SMD GOLD; Price: None; Value: *; Package: None; MP: FSI-110-03-X-D-AD-TR; Availability: Unavailable
J14#1 = SAMTEC-TLE-110-01-X-DV-A: CONN RCPT 20POS 0.079 GOLD SMD; Availability: Unavailable; MP: SAMTEC-TLE-110-01-X-DV-A; Price: None; Value: *; Package: None
R263-R304 R379 R380 R382 R383 R399 R400 = _RES_B_2: RES